# EasyEDA Pro project ProPrj_Devboard_V2_2025-07-15.epro, board PCB1
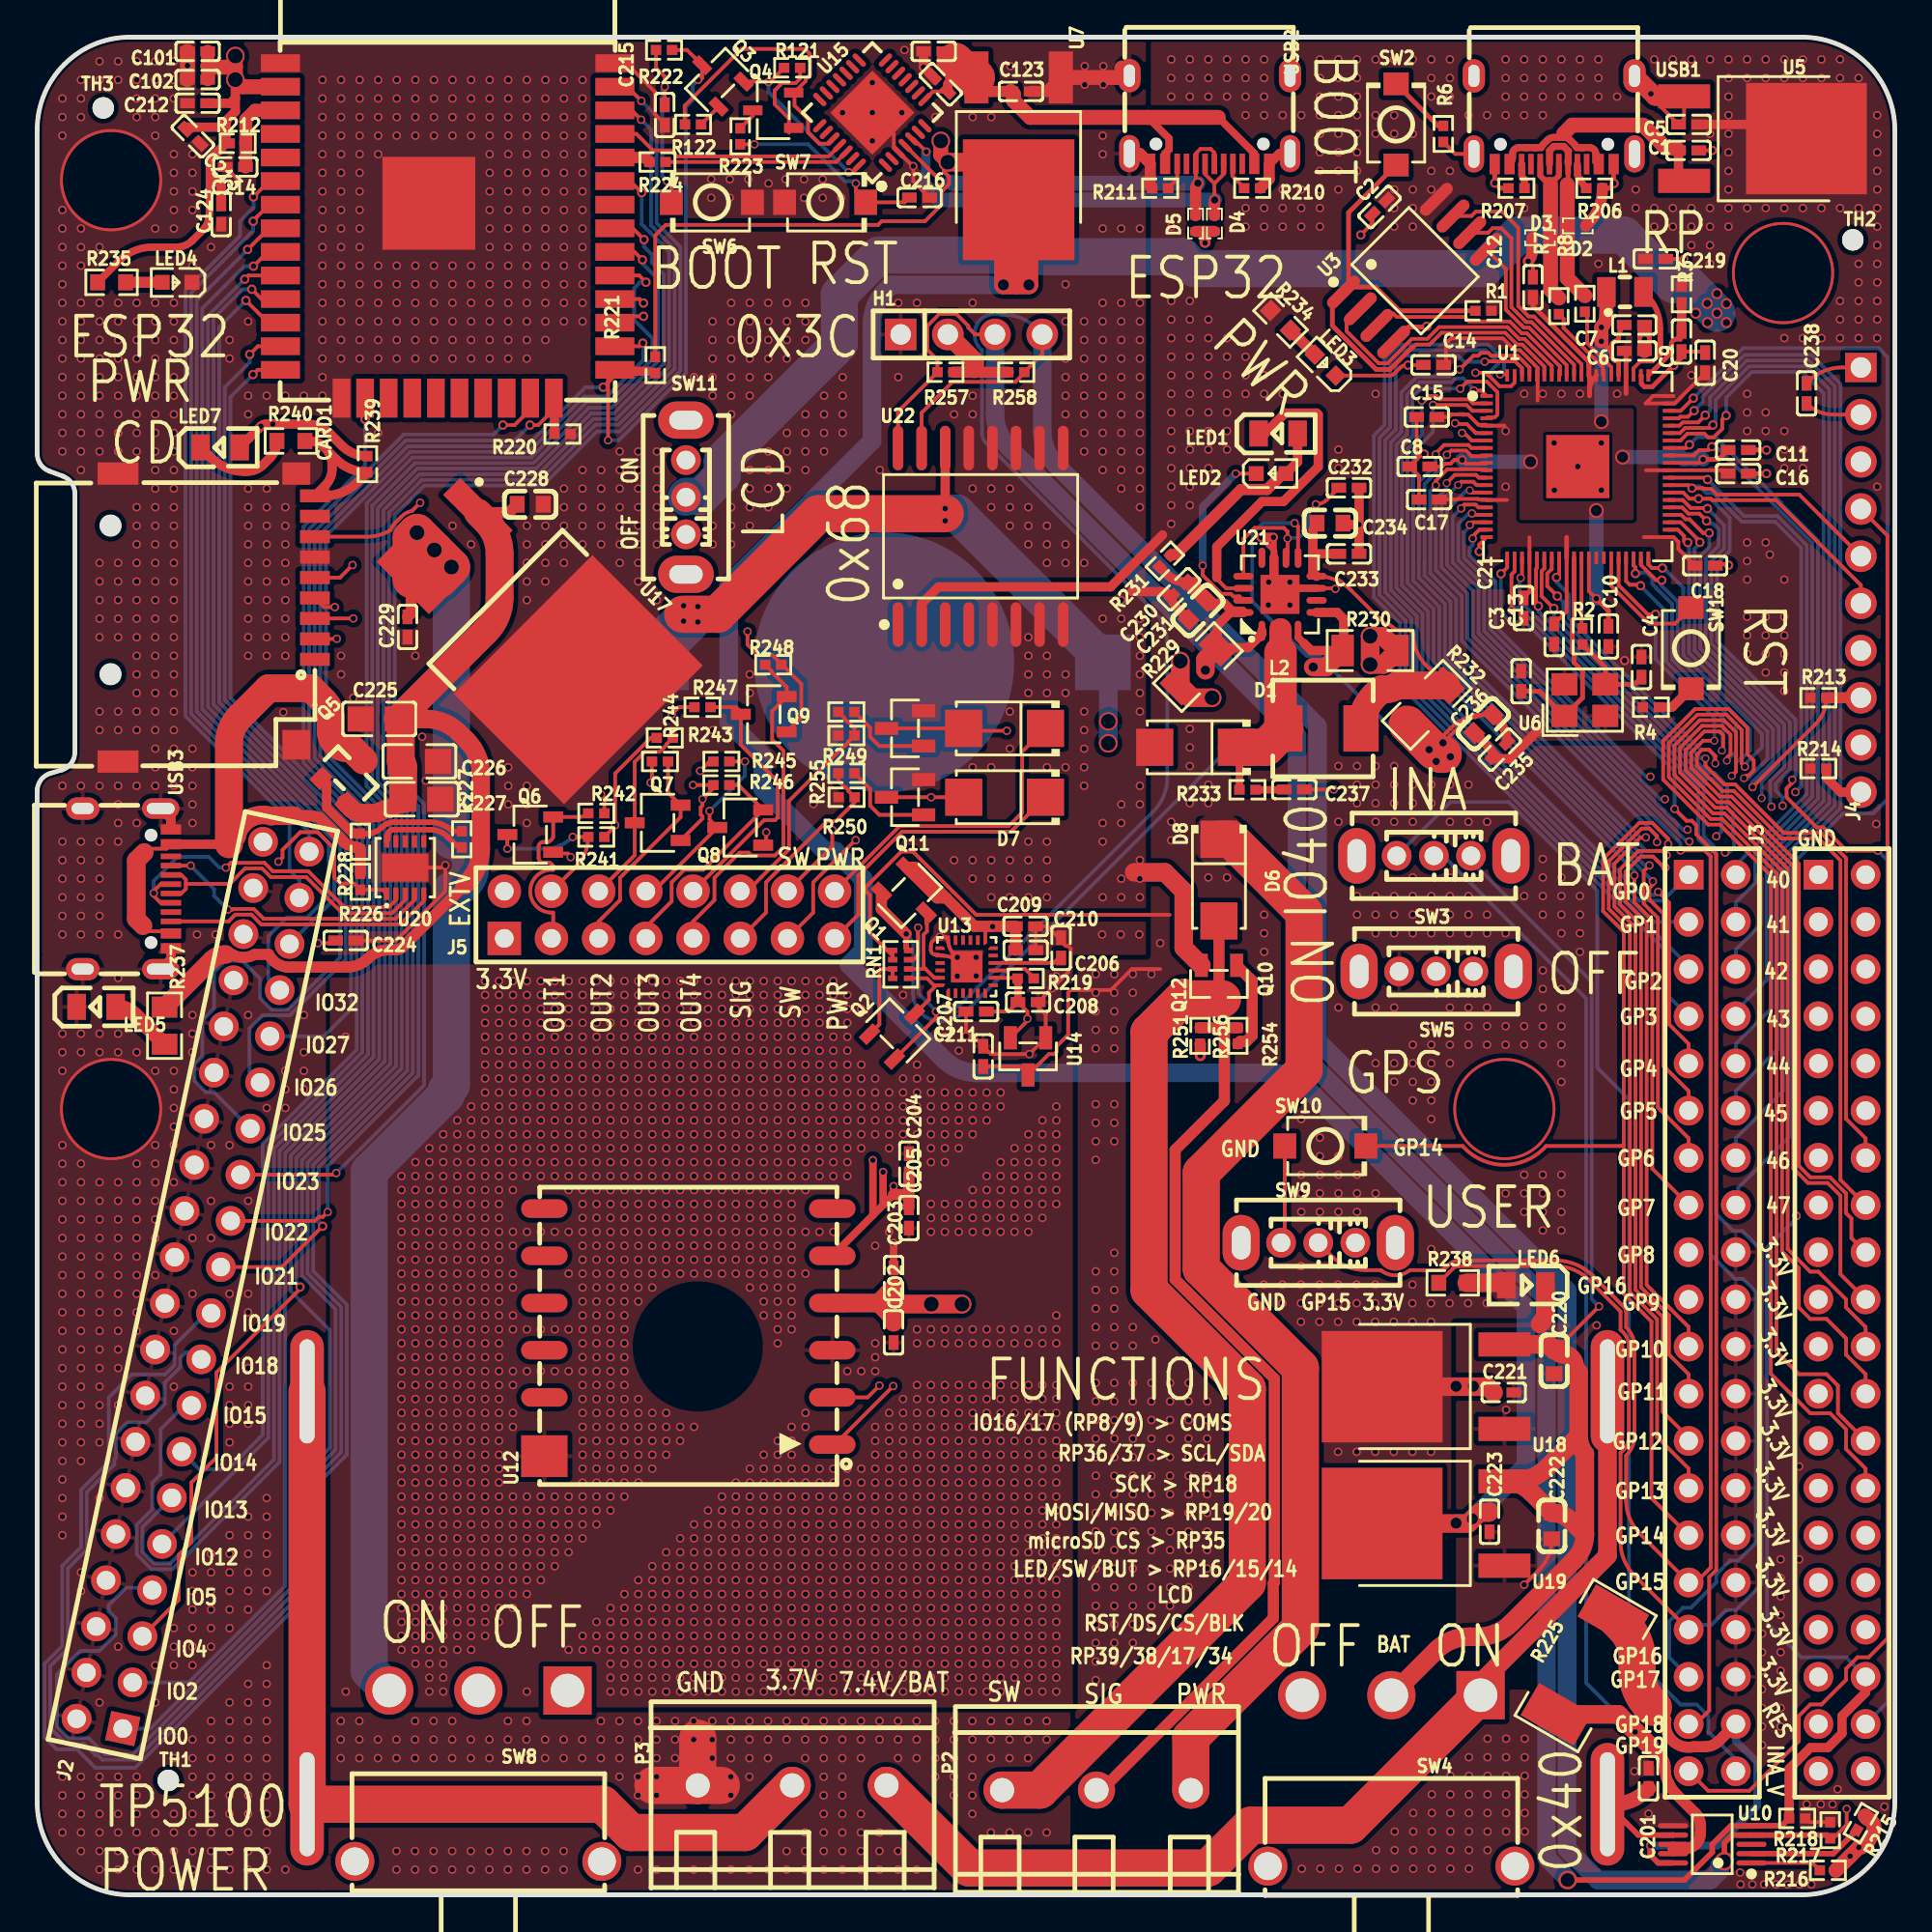
[diagram p7: board, top side]
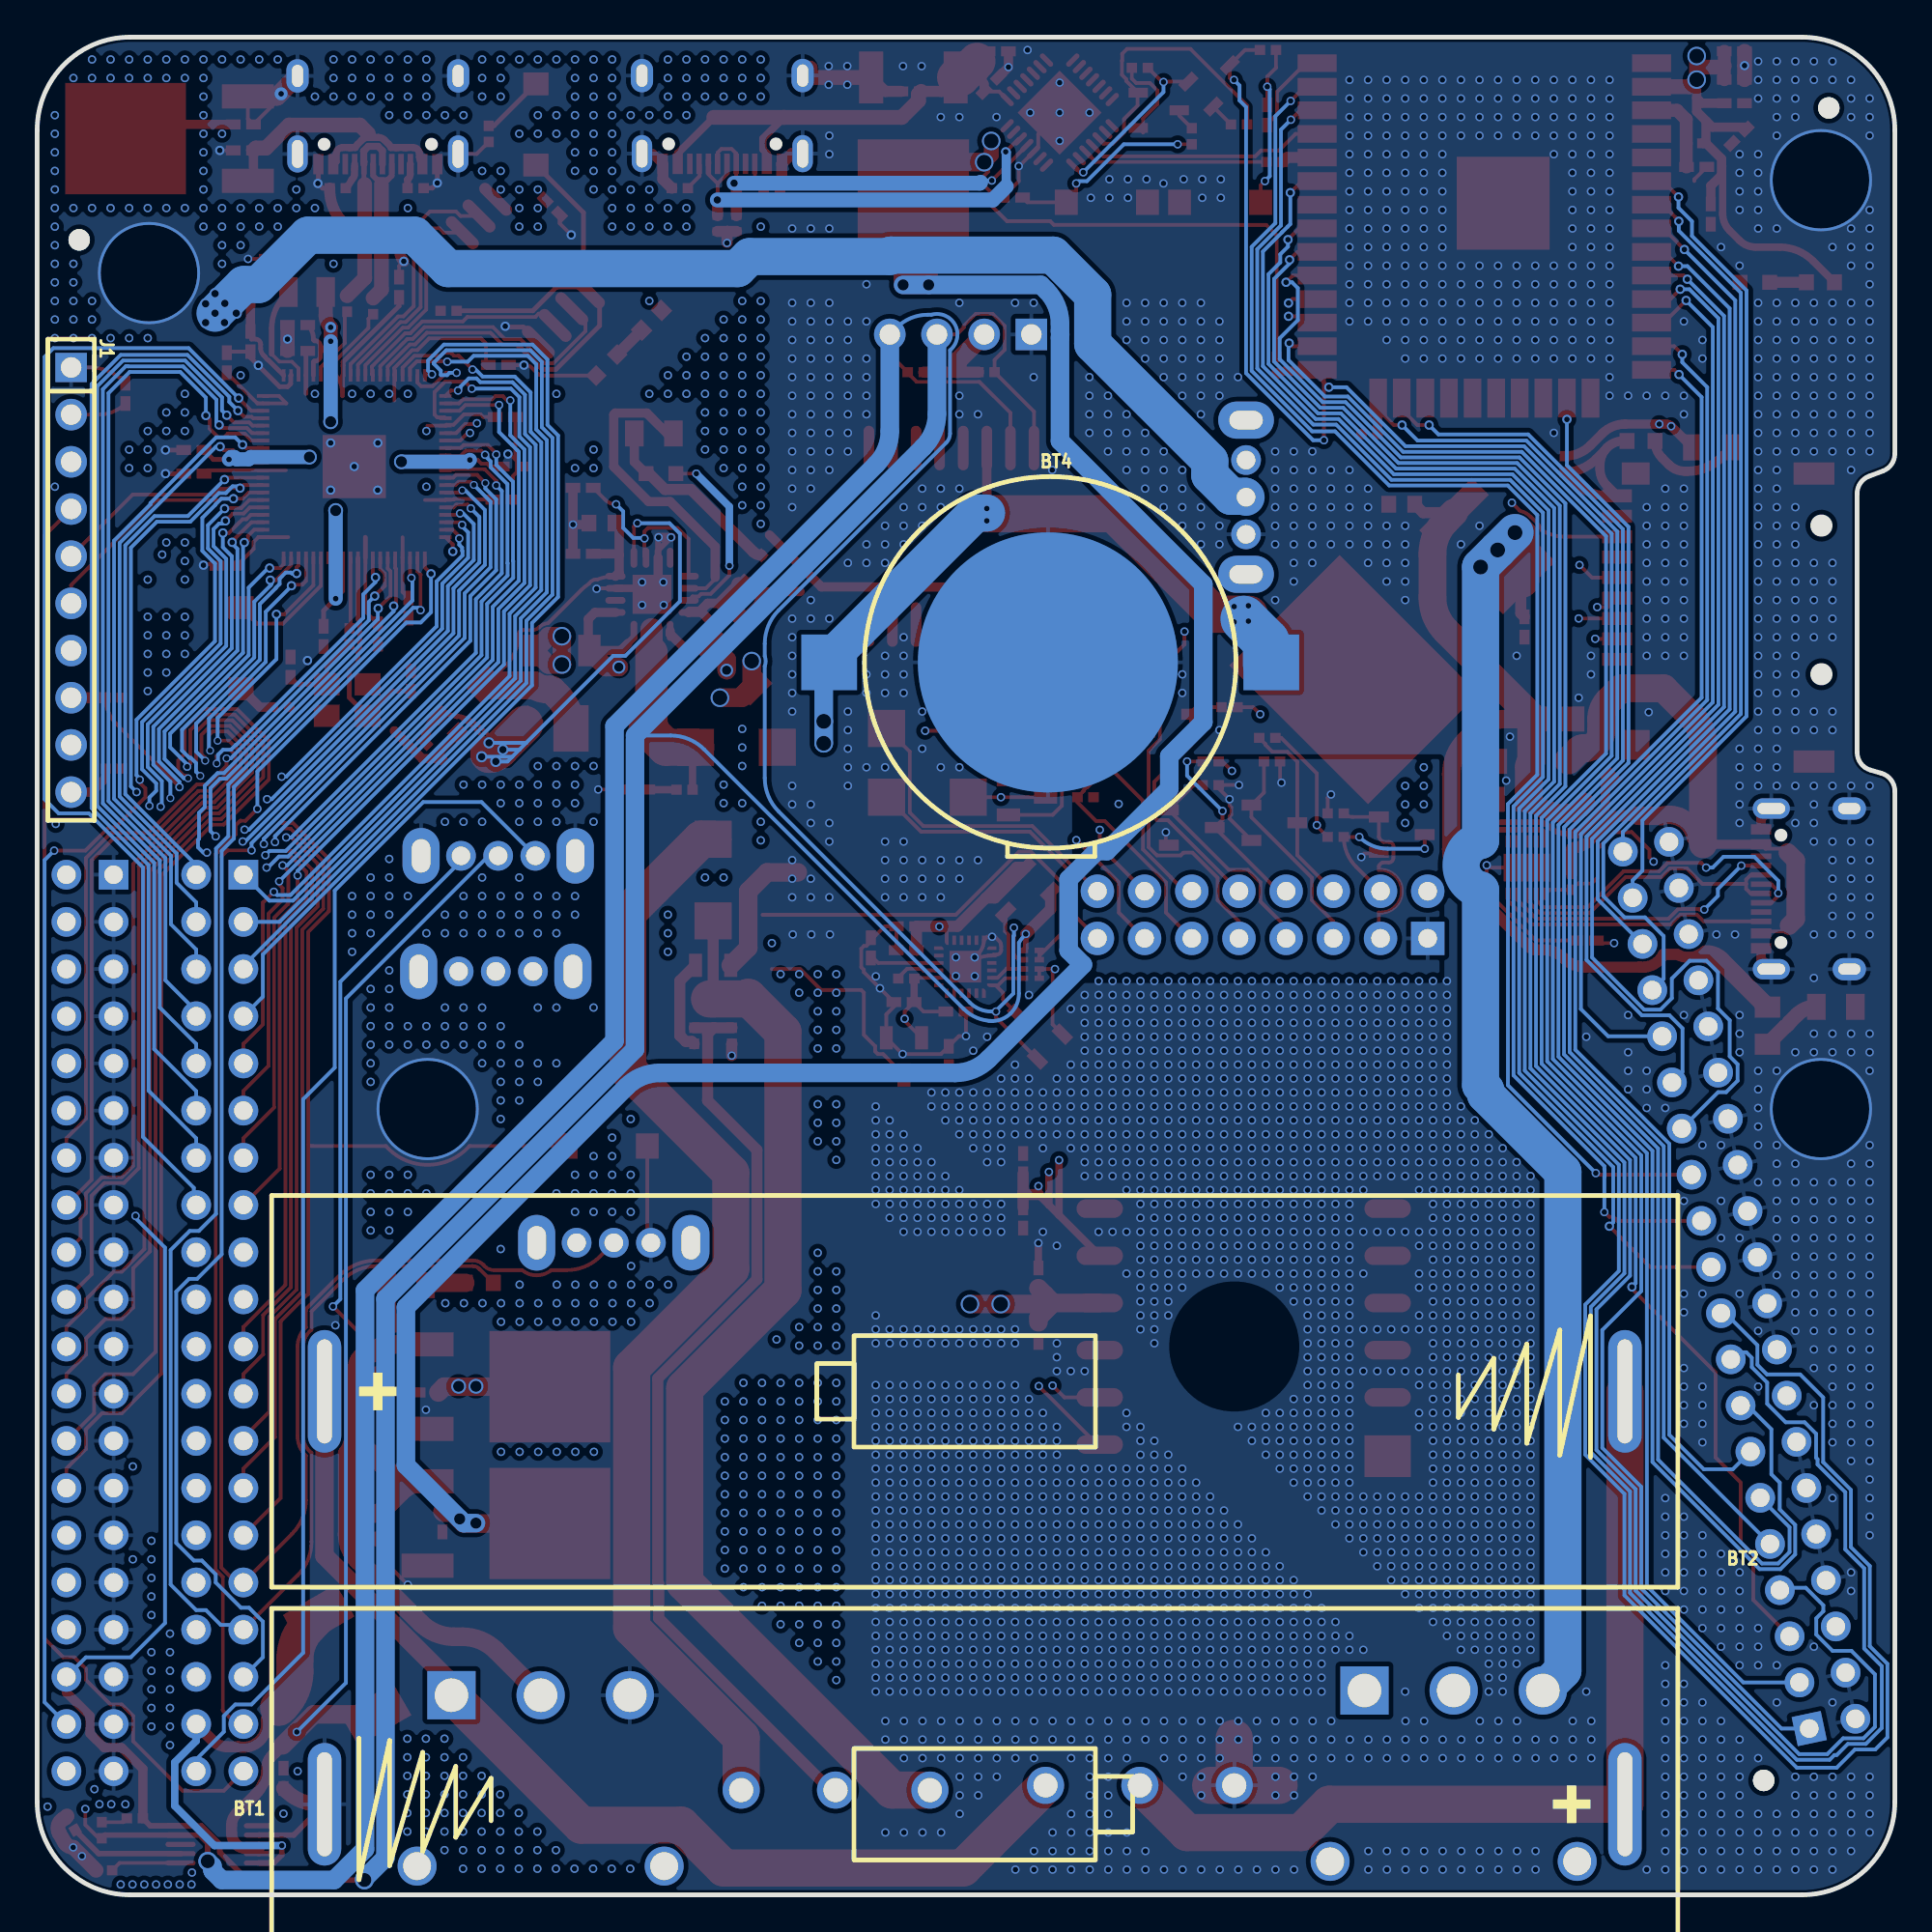
[diagram p8: board, bottom side, seen from below]

Outline 100 x 100 mm; copper layers: Top Layer, Inner1, Inner2, Bottom Layer. Coordinates in mm from the lower left corner of the outline.
Outline path: 0,95 0,77.58 arc(0.18,77.01) 0.65,76.64 1.38,76.37 arc(1.85,76) 2.03,75.43 2.03,61.51 arc(1.83,60.91) 1.31,60.55 0.72,60.37 arc(0.2,60.02) 0,59.41 0,5 arc(1.46,1.46) 5,0 95,0 arc(98.54,1.46) 100,5 100,95 arc(98.54,98.54) 95,100 5,100 arc(1.46,98.54) 0,95
Stack: Top Layer 0.035mm Outer layer thickness 1oz / Dielectric1 0.2104mm 7628 RC49% 8.6mil / Inner1 0.0152mm Inner layer thickness / Dielectric2 1.065mm 1.1mm H/HOZ Copper / Inner2 0.0152mm Inner layer thickness / Dielectric3 0.2104mm 7628 RC49% 8.6mil / Bottom Layer 0.035mm Outer layer thickness 1oz

## Design rules (mm)
template: Custom Config
spacing copperThickness1oz (default): track to track 0.102, other pairs 0.152 to 0.3
spacing copperThickness2oz: track to track 0.203, other pairs 0.152 to 0.3
track width copperThickness1oz (default): min 0.127, default 0.2, max 2.54
track width copperThickness2oz: min 0.203, default 0.254, max 2.54
differential pair differentialPair (default): width min 0.127, default 0.254, max 2.54; gap min 0.152, default 0.152
via viaSize (default): diameter min 0.4, default 0.45, max 10; hole min 0.3, default 0.3, max 6.3
pour e4 uses copperRegion1
pour e1251 uses copperRegion1

## Placement (name value [footprint] x y rotation side)
BT1  BH-18650-A1AJ006  [BAT-TH_BH-18650-A1AJ006]  49.53 4.88 180 bottom
BT2  BH-18650-A1AJ006  [BAT-TH_BH-18650-A1AJ006]  49.53 27.1 0 bottom
BT4  CR2032弯脚电池片铜 3V  [BAT-SMD_CR2032-3V]  45.47 66.34 90 bottom
C1  10uF  [C0402]  88.9 93.9 0 top
C2  100nF  [C0402]  72.26 90.86 45 top
C3  15pF  [C0402]  79.88 65.33 90 top
C4  15pF  [C0402]  86.36 66.09 270 top
C5  10uF  [C0402]  88.9 95.3 180 top
C6  4.7uF  [C0402]  85.98 83.11 0 top
C7  4.7uF  [C0402]  85.98 84.51 0 top
C8  100nF  [C0402]  74.42 76.89 180 top
C9  4.7uF  [C0402]  88.52 83.62 270 top
C10  4.7uF  [C0402]  84.58 67.74 270 top
C11  100nF  [C0402]  91.57 77.77 0 top
C12  100nF  [C0402]  80.52 86.54 90 top
C13  100nF  [C0402]  81.66 67.87 270 top
C14  100nF  [C0402]  75.17 82.36 180 top
C15  100nF  [C0402]  74.8 79.55 180 top
C16  100nF  [C0402]  91.57 76.5 0 top
C17  100nF  [C0402]  74.93 75.11 180 top
C18  100nF  [C0402]  89.79 71.55 0 top
C20  100nF  [C0402]  89.79 82.47 90 top
C21  100nF  [C0402]  80.01 69.27 270 top
C101  10uF  [C0402]  8.64 99.24 180 top
C102  100nF  [C0402]  8.64 97.71 0 top
C123  10uF  [C0402]  52.96 97.08 0 top
C124  10uF  [C0402]  9.91 90.47 270 top
C201  100nF  [C0402]  86.74 6.27 90 top
C202  100nF  [C0402]  46.1 30.28 270 top
C203  10uF  [C0402]  46.1 33.2 270 top
C204  100nF  [C0402]  46.93 39.36 270 top
C205  4.7uF  [C0402]  46.93 36.44 270 top
C206  1uF  [C0402]  53.21 50.85 180 top
C207  1uF  [C0402]  50.93 45.14 270 top
C208  100nF  [C0402]  53.34 48.06 0 top
C209  10uF  [C0402]  53.2 52.14 180 top
C210  100nF  [C0402]  55.12 50.98 90 top
C211  100nF  [C0402]  50.55 47.55 0 top
C212  1uF  [C0402]  8.64 96.44 180 top
C213  22pF  [C0402]  8.38 94.67 315 top
C214  1nF  [C0402]  10.67 93.01 180 top
C215  1nF  [C0402]  33.78 95.81 270 top
C216  1nF  [C0402]  47.5 91.36 0 top
C217  10uF  [C0402]  48.26 99.24 180 top
C218  100nF  [C0402]  48.64 97.46 315 top
C219  10uF  [C0402]  87.12 88.06 0 top
C220  10uF  [C0603]  81.66 28.75 270 top
C221  10uF  [C0402]  78.94 27.04 0 top
C222  10uF  [C0603]  81.53 19.86 270 top
C223  10uF  [C0402]  78.18 20.08 270 top
C224  1uF  [C0402]  16.61 51.37 0 top
C225  4.7uF  [C0805]  18.41 63.3 180 top
C226  4.7uF  [C0805]  20.57 61.01 0 top
C227  4.7uF  [C0805]  20.7 58.98 0 top
C228  330nF  [C0603]  26.54 74.85 0 top
C229  100nF  [C0402]  19.94 68.25 90 top
C230  100nF  [C0402]  61.47 70.28 225 top
C231  10uF  [C0603]  62.48 69.14 45 top
C232  100nF  [C0402]  70.61 75.74 0 top
C233  100nF  [C0402]  70.61 72.19 0 top
C234  10uF  [C0603]  69.6 73.84 180 top
C235  100nF  [C0402]  78.74 61.65 225 top
C236  10uF  [C0603]  77.85 63.04 45 top
C237  15pF  [C0402]  67.67 59.5 0 top
C238  100nF  [C0402]  95.25 80.82 270 top
CARD1  TF PUSH  [TF-SMD_TF-PUSH]  9.65 68.76 270 top
D1  SS34  [SMA_L4.3-W2.6-LS5.2-RD]  62.36 61.77 180 top
D2  ESD05V88D-LC  [DFN1006-2L-BI]  82.93 89.84 180 top
D3  ESD05V88D-LC  [DFN1006-2L-BI]  80.9 89.2 0 top
D4  ESD05V88D-LC  [DFN1006-2L-BI]  63.37 89.97 90 top
D5  ESD05V88D-LC  [DFN1006-2L-BI]  62.36 89.97 90 top
D6  SS34  [SMA_L4.3-W2.6-LS5.2-RD]  52.08 62.79 180 top
D7  SS34  [SMA_L4.3-W2.6-LS5.2-RD]  52.08 59.09 180 top
D8  SS34  [SMA_L4.3-W2.6-LS5.2-RD]  63.61 54.62 270 top
H1  2.54-1*4P母  [HDR-TH_4P-P2.54-V-F]  50.29 84 0 top
J1  PM2.54-1*10  [HDR-TH_10P-P2.54-V-F]  98.17 70.79 270 bottom
J2  2.54-2*20  [HDR-TH_40P-P2.54-V-F-R2-C20-S2.54]  8.38 32.82 78 top
J3  2.54-2*20  [HDR-TH_40P-P2.54-V-F-R2-C20-S2.54]  90.17 30.78 270 top
J4  2.54-2*20  [HDR-TH_40P-P2.54-V-F-R2-C20-S2.54]  97.15 30.78 270 top
J5  2.54-2*8P母  [HDR-TH_16P-P2.54-V-F-R2-C8-S2.54]  34.04 52.76 0 top
L1  AOTA-B201610S3R3-101-T  [IND-SMD_L2.0-W1.6_AOTA-B201610S3R3-101-T]  85.47 86.28 180 top
L2  10uH  [IND-SMD_L5.4-W5.2_FXL0530]  69.21 62.79 0 top
LED1  KT-0805G  [LED0805-R-RD]  66.8 78.66 0 top
LED2  KT-0603R  [LED0603-RD]  66.42 76.5 0 top
LED3  KT-0603R  [LED0603-RD]  69.34 82.35 135 top
LED4  KT-0603R  [LED0603-RD]  7.53 86.8 180 top
LED5  KT-0805Y  [LED0805-R-RD]  3.17 47.8 0 top
LED6  KT-0805G  [LED0805-R-RD]  80.14 32.82 180 top
LED7  KT-0805G  [LED0805-R-RD]  9.85 77.92 0 top
P2  WJ500V-5.08-3P  [CONN-TH_3P-P5.00_WJ500V-5.08-3P]  57.02 5.64 0 top
P3  WJ500V-5.08-3P  [CONN-TH_3P-P5.00_WJ500V-5.08-3P]  40.64 5.89 0 top
Q1  BSS138  [SOT-23-3_L2.9-W1.6-P1.90-LS2.8-BR]  46.99 53.77 135 top
Q2  BSS138  [SOT-23-3_L2.9-W1.6-P1.90-LS2.8-BR]  46.36 46.53 225 top
Q3  S8050-J3Y  [SOT-23-3_L3.0-W1.7-P0.95-LS2.9-BR]  36.58 97.71 315 top
Q4  S8050-J3Y  [SOT-23-3_L3.0-W1.7-P0.95-LS2.9-BR]  39.62 96.06 0 top
Q5  AO3401A  [SOT-23_L2.9-W1.3-P1.90-LS2.4-BR]  16.76 60.25 225 top
Q6  BSS138  [SOT-23-3_L2.9-W1.6-P1.90-LS2.8-BR]  26.54 57.07 0 top
Q7  BSS138  [SOT-23-3_L2.9-W1.6-P1.90-LS2.8-BR]  33.4 57.71 0 top
Q8  BSS138  [SOT-23-3_L2.9-W1.6-P1.90-LS2.8-BR]  37.85 57.45 0 top
Q9  BSS138  [SOT-23-3_L2.9-W1.6-P1.90-LS2.8-BR]  39.11 63.55 0 top
Q10  AO3400A  [SOT-23-3_L2.9-W1.3-P1.90-LS2.4-BR]  46.72 62.79 0 top
Q11  AO3400A  [SOT-23-3_L2.9-W1.3-P1.90-LS2.4-BR]  46.72 59.09 0 top
Q12  AO3400A  [SOT-23-3_L2.9-W1.3-P1.90-LS2.4-BR]  63.61 49.04 90 top
R1  10kΩ  [R0402]  77.85 85.27 0 top
R2  1kΩ  [R0402]  83.18 67.74 90 top
R3  33Ω  [R0402]  88.52 86.16 270 top
R4  1kΩ  [R0402]  86.87 63.93 180 top
R6  1kΩ  [R0402]  75.69 94.79 270 top
R7  27Ω  [R0402]  81.92 85.52 270 top
R8  27Ω  [R0402]  83.31 85.65 270 top
R121  12kΩ  [R0402]  40.64 98.35 0 top
R122  12kΩ  [R0402]  35.31 95.3 0 top
R206  5.1kΩ  [R0402]  83.82 91.87 0 top
R207  5.1kΩ  [R0402]  79.63 91.87 180 top
R210  5.1kΩ  [R0402]  65.4 91.87 0 top
R211  5.1kΩ  [R0402]  60.45 91.87 180 top
R212  10kΩ  [R0402]  10.8 94.28 0 top
R213  10kΩ  [R0402]  95.89 64.44 0 top
R214  10kΩ  [R0402]  95.89 60.63 0 top
R215  10kΩ  [R0402]  98.17 3.86 240 top
R216  10kΩ  [R0402]  96.39 1.32 180 top
R217  10kΩ  [R0402]  96.52 3.48 90 top
R218  10kΩ  [R0402]  94.74 4.11 0 top
R219  4.7kΩ  [R0402]  53.21 49.33 180 top
R220  4.7kΩ  [R0402]  28.28 78.64 0 top
R221  4.7kΩ  [R0402]  33.27 82.35 270 top
R222  470Ω  [R0402]  33.75 99.31 0 top
R223  470Ω  [R0402]  37.85 94.67 90 top
R224  470Ω  [R0402]  33.39 93.28 180 top
R225  20mΩ  [RES-SMD_L6.4-W3.2-R2512]  83.31 12.37 240 top
R226  10Ω  [R0402]  17.4 54.53 270 top
R227  5.1kΩ  [R0402]  22.86 56.82 270 top
R228  49.9kΩ  [R0402]  17.4 56.69 90 top
R229  400mΩ  [R1206]  62.48 66.09 45 top
R230  400mΩ  [R1206]  71.76 66.98 180 top
R231  1kΩ  [R0402]  60.71 71.81 45 top
R232  100mΩ  [R1206]  74.8 64.06 225 top
R233  3Ω  [R0402]  65.15 59.49 0 top
R234  220Ω  [R0603]  66.93 84.76 315 top
R235  220Ω  [R0603]  4.01 86.8 0 top
R237  2.7kΩ  [R0805]  6.86 46.79 270 top
R238  220Ω  [R0603]  76.2 32.94 0 top
R239  10kΩ  [R0402]  17.78 77.01 270 top
R240  220Ω  [R0603]  13.66 78.26 180 top
R241  4.7kΩ  [R0402]  30.1 56.95 180 top
R242  4.7kΩ  [R0402]  30.1 58.22 180 top
R243  4.7kΩ  [R0402]  33.78 62.28 0 top
R244  4.7kΩ  [R0402]  33.53 61.01 0 top
R245  4.7kΩ  [R0402]  36.83 61.01 0 top
R246  4.7kΩ  [R0402]  36.83 59.74 0 top
R247  4.7kΩ  [R0402]  35.81 63.93 0 top
R248  4.7kΩ  [R0402]  39.62 66.22 180 top
R249  10kΩ  [R0402]  43.56 62.41 180 top
R250  10kΩ  [R0402]  43.57 59.09 180 top
R251  10kΩ  [R0402]  62.6 46.24 270 top
R254  1kΩ  [R0402]  43.56 63.68 0 top
R255  1kΩ  [R0402]  43.56 60.38 0 top
R256  1kΩ  [R0402]  64.63 46.24 270 top
R257  10kΩ  [R0402]  48.89 81.97 0 top
R258  10kΩ  [R0402]  52.7 81.97 0 top
RN1  10kΩ  [RES-ARRAY-SMD_0402-8P-L2.0-W1.0-BL]  46.48 50.09 90 top
SW1  TS-1088-AR02016  [SW-SMD_L3.9-W3.0-P4.45]  89.03 67.11 270 top
SW2  TS-1088-AR02016  [SW-SMD_L3.9-W3.0-P4.45]  73.15 95.3 90 top
SW3  SS12D07VG4 087  [SW-TH_SS12D07VG4]  75.18 55.93 180 top
SW4  K3-1391B-51  [SW-TH_K3-1391B-51]  72.9 6.15 0 top
SW5  SS12D07VG4 087  [SW-TH_SS12D07VG4]  75.31 49.71 180 top
SW6  TS-1088-AR02016  [SW-SMD_L3.9-W3.0-P4.45]  36.32 91.11 180 top
SW7  TS-1088-AR02016  [SW-SMD_L3.9-W3.0-P4.45]  42.42 91.11 0 top
SW8  K3-1391B-51  [SW-TH_K3-1391B-51]  23.75 6.4 0 top
SW9  SS12D07VG4 087  [SW-TH_SS12D07VG4]  68.96 35.1 180 top
SW10  TS-1088-AR02016  [SW-SMD_L3.9-W3.0-P4.45]  69.34 40.31 0 top
SW11  SS12D07VG4 087  [SW-TH_SS12D07VG4]  34.92 75.23 90 top
TH1  -  [TOOLING_HOLE_JLCPCB]  7.06 6.16 0 top
TH2  -  [TOOLING_HOLE_JLCPCB]  97.74 89.09 0 top
TH3  -  [TOOLING_HOLE_JLCPCB]  3.56 96.19 0 top
U1  RP2350B  [QFN-80_L10.0-W10.0-P0.40-TL-EP3.4]  82.93 76.89 0 top
U2  ESP32-WROOM-32D-N16  [WIFIM-SMD_39P-L25.5-W18.0-P1.27-BL]  22.1 89.59 270 top
U3  W25Q128JVSIQ  [SOIC-8_L5.3-W5.3-P1.27-LS8.0-BL]  74.17 87.43 315 top
U5  NCP1117DT33RKG  [TO-252-2_L6.6-W6.1-P4.57-LS9.9-TL-CW]  91.95 94.54 0 top
U6  ABM8-272-T3  [CRYSTAL-SMD_4P-L3.2-W2.5-BL]  83.31 64.31 0 top
U7  NCP1117DT33RKG  [TO-252-2_L6.6-W6.1-P4.57-LS9.9-TL-CW]  52.83 94.54 270 top
U10  INA226AIDGSR  [MSOP-10_L3.0-W3.0-P0.50-LS5.0-BL]  90.17 2.72 90 top
U12  L80RE-M37  [GPSM-SMD_12P-L16.0-W16.0-P2.54-BL]  35.05 30.28 90 top
U13  ICM-20948  [QFN-24_L3.0-W3.0-P0.40-BL-EP]  50.04 49.96 0 top
U14  SSP6206-18NR  [SOT-23-3_L2.9-W1.3-P1.90-LS2.4-BR]  53.34 45.14 90 top
U15  CP2102-GMR  [WQFN-28_L5.0-W5.0-P0.50-BL-EP3.2]  44.96 95.94 45 top
U17  L7812CD2T-TR  [TO-263-2_L10.0-W9.1-P5.08-LS15.2-TL]  25.53 69.01 315 top
U18  NCP1117DT33RKG  [TO-252-2_L6.6-W6.1-P4.57-LS9.9-TL-CW]  75.69 27.36 180 top
U19  NCP1117DT33RKG  [TO-252-2_L6.6-W6.1-P4.57-LS9.9-TL-CW]  75.69 19.99 180 top
U20  HUSB238_002DD  [DFN-10_L3.0-W3.0-P0.50-BL-EP2.5]  19.81 55.3 0 top
U21  TP5100  [TQFN-16_L4.0-W4.0-P0.65-BL-EP]  66.9 70.01 0 top
U22  DS3231SN#T&R  [SOIC-16_L10.3-W7.5-P1.27-LS10.3-BL]  50.79 73.13 0 top
USB1  TYPE-C 16PIN 2MD(073)  [USB-C-SMD_TYPE-C-6PIN-2MD-073]  81.66 95.54 180 top
USB2  TYPE-C 16PIN 2MD(073)  [USB-C-SMD_TYPE-C-6PIN-2MD-073]  63.12 95.55 180 top
USB3  TYPE-C 16PIN 2MD(073)  [USB-C-SMD_TYPE-C-6PIN-2MD-073]  4.83 54.15 270 top

## Footprints (pads in the part's own frame, mm; a bottom-side part is the same pattern mirrored in y, then rotated)
BAT-SMD_CR2032-3V
  rect 3x3 smd: 1(0,-11.9) 1(0,11.9)
  round 14 smd: 2(0,0.127)
BAT-TH_BH-18650-A1AJ006
  oval 1.8x6.6 hole 0.8x5.6: 1(-35,0) 2(35,0)
C0402
  rect 0.79x0.54 smd: 1(-0.545,0) 2(0.545,0)
C0603
  rect 0.8x0.9 smd: 1(-0.7,0) 2(0.7,0)
C0805
  rect 1.41x1.35 smd: 1(-1,0) 2(1,0)
CONN-TH_3P-P5.00_WJ500V-5.08-3P
  round 2 hole 1.3: 1(-5.08,0) 2(0,0) 3(5.08,0)
CRYSTAL-SMD_4P-L3.2-W2.5-BL
  rect 1.4x1.2 smd: 1(-1.1,-0.85) 2(1.1,-0.85) 3(1.1,0.85) 4(-1.1,0.85)
DFN1006-2L-BI
  rect 0.45x0.55 smd: 1(-0.425,0) 2(0.425,0)
DFN-10_L3.0-W3.0-P0.50-BL-EP2.5
  rect 0.28x0.665 smd: 1(-1,-1.407) 2(-0.5,-1.407) 3(0,-1.407) 4(0.5,-1.407) 5(1,-1.407) 6(1,1.407) 7(0.5,1.407) 8(0,1.407) 9(-0.5,1.407) 10(-1,1.407)
  rect 2.5x1.5 smd: 11(0,0)
GPSM-SMD_12P-L16.0-W16.0-P2.54-BL
  oval 1x2.5 smd: 1(-6.037,-7.75) 2(-3.498,-7.75) 3(-0.958,-7.75) 4(1.583,-7.75) 5(4.122,-7.75) 6(6.662,-7.75) 7(6.662,7.75) 8(4.122,7.75) 9(1.583,7.75) 10(-0.958,7.75) 11(-3.498,7.75)
  rect 2.25x2.5 smd: 12(-6.662,7.75)
HDR-TH_4P-P2.54-V-F
  rect 1.7x1.7 hole 1.1: 1(-3.81,0)
  round 1.7 hole 1.1: 2(-1.27,0) 3(1.27,0) 4(3.81,0)
HDR-TH_10P-P2.54-V-F
  rect 1.575x1.7 hole 1.1: 1(-11.43,0)
  round 1.7 hole 1.1: 2(-8.89,0) 3(-6.35,0) 4(-3.81,0) 5(-1.27,0) 6(1.27,0) 7(3.81,0) 8(6.35,0) 9(8.89,0) 10(11.43,0)
HDR-TH_16P-P2.54-V-F-R2-C8-S2.54
  rect 1.8x1.8 hole 1: 1(-8.89,-1.27)
  round 1.8 hole 1: 2(-8.89,1.27) 3(-6.35,-1.27) 4(-6.35,1.27) 5(-3.81,-1.27) 6(-3.81,1.27) 7(-1.27,-1.27) 8(-1.27,1.27) 9(1.27,-1.27) 10(1.27,1.27) 11(3.81,-1.27) 12(3.81,1.27) 13(6.35,-1.27) 14(6.35,1.27) 15(8.89,-1.27) 16(8.89,1.27)
HDR-TH_40P-P2.54-V-F-R2-C20-S2.54
  rect 1.6x1.6 hole 1: 1(-24.13,-1.27)
  round 1.6 hole 1: 2(-24.13,1.27) 3(-21.59,-1.27) 4(-21.59,1.27) 5(-19.05,-1.27) 6(-19.05,1.27) 7(-16.51,-1.27) 8(-16.51,1.27) 9(-13.97,-1.27) 10(-13.97,1.27) 11(-11.43,-1.27) 12(-11.43,1.27) 13(-8.89,-1.27) 14(-8.89,1.27) 15(-6.35,-1.27) 16(-6.35,1.27) 17(-3.81,-1.27) 18(-3.81,1.27) 19(-1.27,-1.27) 20(-1.27,1.27) 21(1.27,-1.27) 22(1.27,1.27) 23(3.81,-1.27) 24(3.81,1.27) 25(6.35,-1.27) 26(6.35,1.27) 27(8.89,-1.27) 28(8.89,1.27) 29(11.43,-1.27) 30(11.43,1.27) 31(13.97,-1.27) 32(13.97,1.27) 33(16.51,-1.27) 34(16.51,1.27) 35(19.05,-1.27) 36(19.05,1.27) 37(21.59,-1.27) 38(21.59,1.27) 39(24.13,-1.27) 40(24.13,1.27)
IND-SMD_L2.0-W1.6_AOTA-B201610S3R3-101-T
  rect 1x1.6 smd: 1(-1,0) 2(1,0)
IND-SMD_L5.4-W5.2_FXL0530
  rect 1.9x2.5 smd: 1(-2.05,0) 2(2.05,0)
LED0603-RD
  rect 0.8x0.8 smd: 1(-0.799,0) 2(0.799,0)
LED0805-R-RD
  rect 1x1.399 smd: 1(1.05,0) 2(-1.05,0)
MSOP-10_L3.0-W3.0-P0.50-LS5.0-BL
  oval 0.28x1.62 smd: 1(-1,-2.11) 2(-0.5,-2.11) 3(0,-2.11) 4(0.5,-2.11) 5(1,-2.11) 6(1,2.11) 7(0.5,2.11) 8(0,2.11) 9(-0.5,2.11) 10(-1,2.11)
QFN-24_L3.0-W3.0-P0.40-BL-EP
  custom 0.2x0.506 smd: 1(-1,-1.427) 6(1,-1.427) 13(1,1.427) 18(-1,1.427)
  rect 0.2x0.505 smd: 2(-0.6,-1.427) 3(-0.2,-1.427) 4(0.2,-1.427) 5(0.6,-1.427) 14(0.6,1.427) 15(0.2,1.427) 16(-0.2,1.427) 17(-0.6,1.427)
  custom 0.506x0.2 smd: 7(1.427,-1) 12(1.427,1) 19(-1.427,1) 24(-1.427,-1)
  rect 0.505x0.2 smd: 8(1.427,-0.6) 9(1.427,-0.2) 10(1.427,0.2) 11(1.427,0.6) 20(-1.427,0.6) 21(-1.427,0.2) 22(-1.427,-0.2) 23(-1.427,-0.6)
  rect 1.7x1.7 smd: 25(0,0)
QFN-80_L10.0-W10.0-P0.40-TL-EP3.4
  rect 0.665x0.2 smd: 1(-4.907,3.8) 2(-4.907,3.4) 3(-4.907,3) 4(-4.907,2.6) 5(-4.907,2.2) 6(-4.907,1.8) 7(-4.907,1.4) 8(-4.907,1) 9(-4.907,0.6) 10(-4.907,0.2) 11(-4.907,-0.2) 12(-4.907,-0.6) 13(-4.907,-1) 14(-4.907,-1.4) 15(-4.907,-1.8) 16(-4.907,-2.2) 17(-4.907,-2.6) 18(-4.907,-3) 19(-4.907,-3.4) 20(-4.907,-3.8) 41(4.907,-3.8) 42(4.907,-3.4) 43(4.907,-3) 44(4.907,-2.6) 45(4.907,-2.2) 46(4.907,-1.8) 47(4.907,-1.4) 48(4.907,-1) 49(4.907,-0.6) 50(4.907,-0.2) 51(4.907,0.2) 52(4.907,0.6) 53(4.907,1) 54(4.907,1.4) 55(4.907,1.8) 56(4.907,2.2) 57(4.907,2.6) 58(4.907,3) 59(4.907,3.4) 60(4.907,3.8)
  rect 0.2x0.665 smd: 21(-3.8,-4.907) 22(-3.4,-4.907) 23(-3,-4.907) 24(-2.6,-4.907) 25(-2.2,-4.907) 26(-1.8,-4.907) 27(-1.4,-4.907) 28(-1,-4.907) 29(-0.6,-4.907) 30(-0.2,-4.907) 31(0.2,-4.907) 32(0.6,-4.907) 33(1,-4.907) 34(1.4,-4.907) 35(1.8,-4.907) 36(2.2,-4.907) 37(2.6,-4.907) 38(3,-4.907) 39(3.4,-4.907) 40(3.8,-4.907) 61(3.8,4.907) 62(3.4,4.907) 63(3,4.907) 64(2.6,4.907) 65(2.2,4.907) 66(1.8,4.907) 67(1.4,4.907) 68(1,4.907) 69(0.6,4.907) 70(0.2,4.907) 71(-0.2,4.907) 72(-0.6,4.907) 73(-1,4.907) 74(-1.4,4.907) 75(-1.8,4.907) 76(-2.2,4.907) 77(-2.6,4.907) 78(-3,4.907) 79(-3.4,4.907) 80(-3.8,4.907)
  rect 3.4x3.4 smd: 81(0,0)
R0402
  rect 0.566x0.54 smd: 1(-0.433,0) 2(0.433,0)
R0603
  rect 0.806x0.864 smd: 1(-0.753,0) 2(0.753,0)
R0805
  rect 1.133x1.377 smd: 1(-1,0) 2(1,0)
R1206
  rect 1.208x1.701 smd: 1(-1.479,0) 2(1.479,0)
RES-ARRAY-SMD_0402-8P-L2.0-W1.0-BL
  rect 0.3x0.505 smd: 1(-0.75,0.427) 2(-0.25,0.427) 3(0.25,0.427) 4(0.75,0.427) 5(0.75,-0.427) 6(0.25,-0.427) 7(-0.25,-0.427) 8(-0.75,-0.427)
RES-SMD_L6.4-W3.2-R2512
  rect 2x3.3 smd: 1(-3.067,0) 2(3.067,0)
SMA_L4.3-W2.6-LS5.2-RD
  rect 2x2 smd: 1(-2.2,0) 2(2.2,0)
SOIC-8_L5.3-W5.3-P1.27-LS8.0-BL
  oval 0.63x2.25 smd: 1(-1.905,-3.53) 2(-0.635,-3.53) 3(0.635,-3.53) 4(1.905,-3.53) 5(1.905,3.53) 6(0.635,3.53) 7(-0.635,3.53) 8(-1.905,3.53)
SOIC-16_L10.3-W7.5-P1.27-LS10.3-BL
  oval 0.574x2.401 smd: 1(-4.445,-4.75) 2(-3.175,-4.75) 3(-1.905,-4.75) 4(-0.635,-4.75) 5(0.635,-4.75) 6(1.905,-4.75) 7(3.175,-4.75) 8(4.445,-4.75) 9(4.445,4.75) 10(3.175,4.75) 11(1.905,4.75) 12(0.635,4.75) 13(-0.635,4.75) 14(-1.905,4.75) 15(-3.175,4.75) 16(-4.445,4.75)
SOT-23-3_L2.9-W1.3-P1.90-LS2.4-BR
  rect 1.25x0.7 smd: 1(1,-0.95) 2(1,0.95) 3(-1,0)
SOT-23-3_L2.9-W1.6-P1.90-LS2.8-BR
  rect 1.07x0.6 smd: 1(1.235,-0.95) 2(1.235,0.95) 3(-1.235,0)
SOT-23-3_L3.0-W1.7-P0.95-LS2.9-BR
  rect 1.038x0.532 smd: 1(1.102,-0.95) 2(1.102,0.95) 3(-1.101,0)
SOT-23_L2.9-W1.3-P1.90-LS2.4-BR
  rect 1x0.8 smd: 1(1.15,-0.95) 2(1.15,0.95) 3(-1.15,0)
SW-SMD_L3.9-W3.0-P4.45
  rect 1.23x1.36 smd: 1(-2.185,0) 2(2.185,0)
SW-TH_K3-1391B-51
  rect 2.6x2.6 hole 1.8: 1(4.8,4.6)
  round 2.6 hole 1.8: 2(0,4.6) 3(-4.8,4.6)
  round 2.1 hole 1.5: 4(-6.65,-4.6) 4(6.65,-4.6)
SW-TH_SS12D07VG4
  oval 1.6x1.6 hole 1: 1(-2,0) 2(0,0) 3(2,0)
  oval 2x3 hole 1x1.8: 4(4.15,0) 5(-4.15,0)
TF-SMD_TF-PUSH
  rect 0.7x1.6 smd: 1(2.25,5.3) 2(1.15,5.3) 3(0.05,5.3) 4(-1.05,5.3) 5(-2.15,5.3) 6(-3.25,5.3) 7(-4.35,5.3) 8(-5.45,5.3) CD(-6.55,5.3)
  rect 1.2x1.5 smd: 10(-7.75,4.3)
  rect 1.2x2.2 smd: 11(-7.75,-5.3) 12(7.75,-5.3)
  rect 1.6x1.5 smd: 13(6.85,4.3)
TO-252-2_L6.6-W6.1-P4.57-LS9.9-TL-CW
  rect 2.8x1.3 smd: 1(-3.292,2.273) 3(-3.292,-2.273)
  rect 6.5x6 smd: 2(3.292,0)
TO-263-2_L10.0-W9.1-P5.08-LS15.2-TL
  rect 4x1.3 smd: 1(-5.086,2.54) 3(-5.086,-2.54)
  rect 8.4x10.566 smd: 4(5.086,0)
TOOLING_HOLE_JLCPCB
  round 1.152 hole 1.152: 0(0,0)
TQFN-16_L4.0-W4.0-P0.65-BL-EP
  oval 0.364x1.087 smd: 1(-0.975,-1.968) 2(-0.325,-1.968) 3(0.325,-1.968) 4(0.975,-1.968) 9(0.975,1.968) 10(0.325,1.968) 11(-0.325,1.968) 12(-0.975,1.968)
  oval 1.087x0.364 smd: 5(1.968,-0.975) 6(1.968,-0.325) 7(1.968,0.325) 8(1.968,0.975) 13(-1.968,0.975) 14(-1.968,0.325) 15(-1.968,-0.325) 16(-1.968,-0.975)
  rect 2.1x2.1 smd: 17(0,0)
USB-C-SMD_TYPE-C-6PIN-2MD-073
  rect 0.55x1.1 smd: 1(-3.2,2.375) 2(-2.4,2.375) 11(2.4,2.375) 12(3.2,2.375)
  rect 0.3x1.1 smd: 3(-1.75,2.375) 4(-1.25,2.375) 5(-0.75,2.375) 6(-0.25,2.375) 7(0.25,2.375) 8(0.75,2.375) 9(1.25,2.375) 10(1.75,2.375)
  oval 1.1x2 hole 0.6x1.5: 13(-4.325,1.825) 14(4.325,1.825)
  oval 1.2x1.8 hole 0.6x1.2: 13(-4.325,-2.375) 14(4.325,-2.375)
WIFIM-SMD_39P-L25.5-W18.0-P1.27-BL
  rect 0.95x2.1 smd: 1(-9.015,-9) 2(-7.745,-9) 3(-6.475,-9) 4(-5.205,-9) 5(-3.935,-9) 6(-2.665,-9) 7(-1.395,-9) 8(-0.125,-9) 9(1.145,-9) 10(2.415,-9) 11(3.685,-9) 12(4.955,-9) 13(6.225,-9) 14(7.495,-9) 25(7.495,9) 26(6.225,9) 27(4.955,9) 28(3.685,9) 29(2.415,9) 30(1.145,9) 31(-0.125,9) 32(-1.395,9) 33(-2.665,9) 34(-3.935,9) 35(-5.205,9) 36(-6.475,9) 37(-7.745,9) 38(-9.015,9)
  rect 2.1x0.95 smd: 15(9.015,-5.715) 16(9.015,-4.445) 17(9.015,-3.175) 18(9.015,-1.905) 19(9.015,-0.635) 20(9.015,0.635) 21(9.015,1.905) 22(9.015,3.175) 23(9.015,4.445) 24(9.015,5.715)
  rect 5x5 smd: 39(-1.472,-1.017)
WQFN-28_L5.0-W5.0-P0.50-BL-EP3.2
  oval 0.28x0.9 smd: 1(-1.502,-2.5) 2(-1.001,-2.5) 3(-0.5,-2.5) 4(0,-2.5) 5(0.5,-2.5) 6(1,-2.5) 7(1.501,-2.5) 15(1.501,2.5) 16(1,2.5) 17(0.5,2.5) 18(0,2.5) 19(-0.5,2.5) 20(-1.001,2.5) 21(-1.502,2.5)
  oval 0.9x0.28 smd: 8(2.5,-1.502) 9(2.5,-1.001) 10(2.5,-0.5) 11(2.5,0) 12(2.5,0.5) 13(2.5,1) 14(2.5,1.501) 22(-2.5,1.501) 23(-2.5,1) 24(-2.5,0.5) 25(-2.5,0) 26(-2.5,-0.5) 27(-2.5,-1.001) 28(-2.5,-1.502)
  rect 3.2x3.2 smd: 29(0,0)

## Nets
As in the schematic, except:
$4N7638: C238.2 J1.2 SW11.2

Pads without a net: CARD1 1 8; SW4 4; SW5 1 4 5; SW8 1 4; SW9 1 4 5; SW11 4 5; TH1 0; TH2 0; TH3 0; U2 4 5 17 18 19 20 21 22 32; U12 6 7 8 9 10 11; U13 1 2 3 4 5 6 14 15 16 17 19; U15 6 7 9 10 11 12 13 14 15 16 17 18 19 20 21 22; U20 6 7 8 9; U21 6 12; USB1 3 9; USB2 3 9; USB3 3 9

## Via types
v1: diameter 0.45, hole 0.3, Top Layer to Bottom Layer, 3710 vias
v2: diameter 0.5, hole 0.305, Top Layer to Bottom Layer, 69 vias
v3: diameter 0.5, hole 0.3, Top Layer to Bottom Layer, 2 vias
v4: diameter 5.5, hole 5.2, Top Layer to Bottom Layer, 4 vias
v5: diameter 0.7, hole 0.305, Top Layer to Bottom Layer, 1 via
v6: diameter 0.8, hole 0.6, Top Layer to Bottom Layer, 10 vias
v7: diameter 0.6, hole 0.305, Top Layer to Bottom Layer, 2 vias
v8: diameter 0.42, hole 0.3, Top Layer to Bottom Layer, 11 vias
v9: diameter 1, hole 0.75, Top Layer to Bottom Layer, 2 vias
v10: diameter 0.45, hole 0.305, Top Layer to Bottom Layer, 1 via
v11: diameter 1, hole 0.8, Top Layer to Bottom Layer, 15 vias
v12: diameter 0.6, hole 0.4, Top Layer to Bottom Layer, 13 vias
v13: diameter 0.7, hole 0.5, Top Layer to Bottom Layer, 2 vias

## Routing (per net, layer and track width the routed paths; a pad name or vN(x,y) marks a point on that pad's centre or on a via; arc(x,y) is an arc through that point)
1.1V: length 35.1
  Top Layer w0.2: U1.32 83.53,70.17 v2(83.93,69.77) ; C8.1 75.63,76.89 75.78,77.04 76.08,77.04 76.28,77.24 v2(76.71,77.24) 76.91,77.04 77.98,77.04 U1.10 ; U1.51 89.49,77.09 v2(89.68,77.27)
  Top Layer w0.254: v7(84.2,83.63) 84.6,83.24 arc(84.72,83.05) 84.76,82.84 ; U1.65 85.13,82.51 arc(85.11,82.54) 85.08,82.56 85.04,82.56 arc(84.84,82.64) 84.76,82.84 ; C11.1 90.51,77.27 v2(89.68,77.27) ; C10.1 84.58,69.12 v2(83.93,69.77) ; 84.76,82.84 84.76,83.38 arc(84.84,83.58) 85.04,83.66 85.07,83.66 arc(85.11,83.68) 85.13,83.72 85.13,83.77 arc(85.21,84.17) C7.1
  Top Layer w0.762: v7(84.2,83.63) v7(84.2,84.38) arc(84.4,84.68) 84.47,85.03 L1.2
  Bottom Layer w0.762: v6(85.34,77.4) 88.5,77.4 88.62,77.28 89.27,77.28 89.39,77.4 89.55,77.4 v2(89.68,77.27) ; v6(84.2,79.3) v7(84.2,83.63) ; v6(83.93,74.52) v2(83.93,69.77) ; v2(76.71,77.24) 76.81,77.14 v6(80.39,77.14)
1.8V: length 37.2
  Top Layer w0.2: Q2.1 45.34,46.86 45.34,49.71 v1(45.21,49.83) 46.05,49.83 RN1.2 RN1.1 ; 51.32,52.14 51.04,51.85 U13.13 ; U14.2 53.3,47.05 v1(53.3,47.16) 53.3,47.55 C208.1 52.29,47.55 C211.2 ; 51.42,52.14 v1(51.43,52.12) ; U13.8 52.74,49.36
  Top Layer w0.4: R219.2 52.8,49.31 C208.1
  Top Layer w0.6: C206.2 52.67,52.13 C209.2 50.46,52.14 48.93,53.66 ; 48.93,53.66 48.44,53.66 Q1.1 47.27,55.32 48.93,53.66
  Inner2 w0.2: v1(53.3,47.16) 53.3,50.25 v1(51.43,52.12) 50.17,52.12 47.88,49.83 v1(45.21,49.83)
3.3V: length 144.7
  Top Layer w0.2: C21.1 80.33,70.13 U1.24 80.33,73.08 ; U1.60 86.98,80.69 86.58,80.29 U1.59 88.15,80.29 C20.1 ; v1(30.35,59.23) 30.53,59.05 R242.1 ; C18.1 88.35,72.45 88.35,72.82 88.09,73.09 U1.41 86.49,73.09 ; v1(35.31,59.74) R246.1 36.4,59.56 v1(35.81,58.98) 35.81,58.64 35.72,58.54 35.72,58.15 35.81,58.05 35.81,57.94 Q7.1 ; 60.45,49.83 58.93,49.83 57.8,48.71 55.64,48.71 55.5,48.56 55.5,46.29 54.89,45.69 54.89,45.41 54.74,45.26 54.46,45.26 U14.3 52.89,44.59 C207.2 ; 75.84,82.49 75.84,83.51 76.12,83.79 78.9,83.79 79.53,83.15 79.82,83.15 80.78,82.19 80.78,81.84 U1.76 80.77,81.75 80.77,80.44 ; C17.1 76.45,75.11 76.49,75.14 77.56,75.14 77.59,75.11 78,75.11 U1.15 79.12,75.09 ; 46.05,50.55 44.83,51.77 44.83,53.81 44.68,53.96 arc(44.6,54.14) 44.68,54.32 46.52,56.16 47.14,56.16 50.55,52.76 60.96,52.76 ; 46.05,50.55 RN1.3 ; 46.05,50.55 RN1.4 ; CARD1.4 15.44,69.32 v1(16.02,69.32) ; v1(38.24,68) 38.24,67.31 38.8,66.74 39.58,66.74 41.14,65.18 41.14,63.39 Q9.1 ; 33.09,61.01 33.09,59.94 v1(33.02,59.87) ; U1.29 82.33,69.08 C13.1 ; R217.2 95.38,3.91 R218.2 ; 86.61,76.69 U1.50 90.84,76.69 C16.1 ; Q6.1 27.84,56.06 28.58,56.06 ; v1(39.24,57.2) 39.24,56.67 39.08,56.5 ; C15.1 75.99,79.55 76.13,79.69 77.03,79.69 77.59,79.13 77.98,79.13 U1.5 78.99,79.09
  Top Layer w0.254: U1.29 82.33,73.08 ; 83.57,80.91 83.57,80.7 ; 83.57,80.91 83.57,81.71 arc(83.56,81.75) U1.69 83.53,82.33 ; 83.57,80.91 arc(83.66,81.39) U1.68 ; 85.53,80.82 U1.64 85.53,82.87 arc(85.51,83) C6.1 ; 80.52,85.99 80.52,85.53 83.53,82.52 83.53,82.33 arc(83.53,82.34) 83.53,82.34
  Top Layer w0.5: U22.2 47.61,69.51 48.51,70.41 57.79,70.41 60.58,73.2 ; U5.2 94.48,95.3 89.45,95.3 ; LED7.1 v1(12.04,79.06) arc(12.17,79.14) 12.32,79.17 v1(12.68,79.17) 14.52,79.17 arc(15.19,79.04) 15.75,78.66 16.39,78.02 arc(17.03,77.6) R239.1
  Top Layer w0.6: R257.2 R258.1
  Top Layer w1: U18.2 78.09,27.36 C221.1 ; 50.46,82.15 50.46,82.56 H1.2
  vias: v1(28.72,55.86) v1(56.98,49.56) v1(56.98,48.56) v1(56.98,47.56) v1(56.98,46.56) v1(56.98,45.56) v1(56.98,42.56) v1(56.98,41.56) v1(56.98,40.56) v1(56.98,39.56) v1(56.98,33.56) v1(56.98,32.56) v1(56.98,31.56) v1(56.98,30.56) v1(56.98,29.56) v1(56.98,27.56) v1(56.98,26.56) v1(56.98,25.56) v1(56.98,24.56) v1(56.98,23.56) v1(56.98,22.56) v1(56.98,21.56) v1(56.98,20.56) v1(56.98,19.56) v1(56.98,18.56) v1(56.98,17.56) v1(56.98,16.56) v1(56.98,15.56) v1(56.98,14.56) v1(56.98,13.56) v1(56.98,12.56) v1(56.98,11.56) v1(57.98,49.56) v1(57.98,48.56) v1(57.98,47.56) v1(57.98,46.56) v1(57.98,45.56) v1(57.98,42.56) v1(57.98,41.56) v1(57.98,40.56) v1(57.98,34.56) v1(57.98,33.56) v1(57.98,32.56) v1(57.98,31.56) v1(57.98,30.56) v1(57.98,29.56) v1(57.98,27.56) v1(57.98,26.56) v1(57.98,25.56) v1(57.98,24.56) v1(57.98,23.56) v1(57.98,22.56) v1(57.98,21.56) v1(57.98,20.56) v1(57.98,19.56) v1(57.98,18.56) v1(57.98,17.56) v1(57.98,16.56) v1(57.98,15.56) v1(57.98,14.56) v1(57.98,13.56) v1(57.98,12.56) v1(58.98,49.56) v1(58.98,48.56) v1(58.98,30.56) v1(58.98,29.56) v1(58.98,27.56) v1(58.98,26.56) v1(58.98,25.56) v1(58.98,24.56) v1(58.98,23.56) v1(58.98,22.56) v1(58.98,21.56) v1(58.98,20.56) v1(58.98,19.56) v1(58.98,18.56) v1(58.98,17.56) v1(58.98,16.56) v1(58.98,15.56) v1(58.98,14.56) v1(58.98,13.56) v1(59.98,49.56) v1(59.98,27.56) v1(59.98,26.56) v1(59.98,25.56) v1(59.98,24.56) v1(59.98,23.56) v1(59.98,22.56) v1(59.98,21.56) v1(59.98,20.56) v1(59.98,19.56) v1(59.98,18.56) v1(59.98,17.56) v1(59.98,16.56) v1(59.98,15.56) v1(59.98,14.56) v1(60.2,29.9) v1(60.45,51.23) v1(60.98,27.56) v1(60.98,26.56) v1(60.98,25.56) v1(60.98,24.56) v1(60.98,23.56) v1(60.98,22.56) v1(60.98,21.56) v1(60.98,20.56) v1(60.98,19.56) v1(60.98,18.56) v1(60.98,17.56) v1(60.98,16.56) v1(60.98,15.56) v1(61.05,98.8) v1(61.05,97.8) v1(61.05,96.8) v1(61.05,89.8) v1(61.05,85.8) v1(61.05,84.8) v1(61.05,83.8) v1(61.05,82.8) v1(61.05,81.8) v1(61.05,80.8) v1(61.05,79.8) v1(61.05,78.8) v1(61.05,77.8) v1(61.05,76.8) v1(61.05,75.8) v1(61.05,74.8) v1(61.05,73.8) v1(61.05,57.76) v1(61.05,56.76) v1(61.98,27.56) v1(61.98,26.56) v1(61.98,25.56) v1(61.98,24.56) v1(61.98,23.56) v1(61.98,22.56) v1(61.98,21.56) v1(61.98,20.56) v1(61.98,19.56) v1(61.98,18.56) v1(61.98,17.56) v1(61.98,16.56) v1(62.05,98.8) v1(62.05,97.8) v1(62.05,96.8) v1(62.05,85.8) v1(62.05,84.8) v1(62.05,83.8) v1(62.05,82.8) v1(62.05,81.8) v1(62.05,80.8) v1(62.05,79.8) v1(62.05,78.8) v1(62.05,77.8) v1(62.05,76.8) v1(62.05,75.8) v1(62.05,74.8) v1(62.05,62.76) v1(62.05,61.76) v1(62.05,60.76) v1(62.05,58.76) v1(62.98,26.56) v1(62.98,25.56) v1(62.98,24.56) v1(62.98,23.56) v1(62.98,22.56) v1(62.98,21.56) v1(62.98,20.56) v1(62.98,19.56) v1(62.98,18.56) v1(62.98,17.56) v1(63.05,98.8) v1(63.05,97.8) v1(63.05,96.8) v1(63.05,84.8) v1(63.05,83.8) v1(63.05,82.8) v1(63.05,81.8) v1(63.05,80.8) v1(63.05,79.8) v1(63.05,78.8) v1(63.05,77.8) v1(63.05,76.8) v1(63.05,59.76) v1(63.05,58.76) v1(63.05,54.76) v1(64.05,98.8) v1(64.05,97.8) v1(64.05,96.8) v1(64.05,83.8) v1(64.05,82.8) v1(64.05,81.8) v1(64.05,80.8) v1(64.05,79.8) v1(64.05,78.8) v1(64.05,77.8) v1(64.05,54.76) v1(65.05,98.8) v1(65.05,97.8) v1(65.05,96.8) v1(65.05,95.8) v1(65.05,90.8) v1(65.05,89.8) v1(65.05,82.8) v1(65.05,81.8) v1(65.05,80.8) v1(66.05,98.8) v1(66.05,97.8) v1(66.05,96.8) v1(66.05,95.8) v1(66.05,90.8) v1(66.05,89.8) v1(66.05,81.8) v1(66.05,80.8) v1(66.05,52.76) v1(66.05,51.76) v1(66.05,50.76) v1(66.03,32.85) v1(67.05,95.8) v1(67.05,91.8) v1(67.05,90.8) v1(67.05,89.8) v1(67.05,85.8) v1(67.05,80.8) v1(67.03,32.85) v1(67.03,31.85) v1(68.05,95.8) v1(68.05,91.8) v1(68.05,90.8) v1(68.05,89.8) v1(68.05,41.76) v1(68.05,38.76) v1(68.05,37.76) v1(68.05,36.76) v1(68.03,33.85) v1(68.03,32.85) v1(68.03,31.85) v1(68.03,30.85) v1(68.07,1.41) v1(69.05,98.8) v1(69.05,97.8) v1(69.05,96.8) v1(69.05,95.8) v1(69.05,94.8) v1(69.05,93.8) v1(69.05,92.8) v1(69.05,91.8) v1(69.05,90.8) v1(69.05,89.8) v1(69.05,40.76) v1(69.05,39.76) v1(69.05,38.76) v1(69.05,37.76) v1(69.05,36.76) v1(69.03,32.85) v1(69.03,31.85) v1(69.03,30.85) v1(69.07,1.41) v1(70.05,98.8) v1(70.05,97.8) v1(70.05,96.8) v1(70.05,95.8) v1(70.05,94.8) v1(70.05,93.8) v1(70.05,92.8) v1(70.05,91.8) v1(70.05,77.8) v1(70.05,76.8) v1(70.05,60.76) v1(70.05,57.76) v1(70.05,47.76) v1(70.05,39.76) v1(70.05,38.76) v1(70.05,37.76) v1(70.05,36.76) v1(70.03,32.85) v1(70.03,31.85) v1(70.03,30.85) v1(70.03,23.85) v1(70.07,1.41) v1(71.05,98.8) v1(71.05,97.8) v1(71.05,96.8) v1(71.05,95.8) v1(71.05,94.8) v1(71.05,93.8) v1(71.05,92.8) v1(71.05,76.8) v1(71.05,60.76) v1(71.05,59.76) v1(71.05,58.76) v1(71.05,53.76) v1(71.05,52.76) v1(71.05,38.76) v1(71.05,37.76) v1(71.05,36.76) v1(71.03,32.85) v1(71.03,31.85) v1(71.03,30.85) v1(71.03,23.85) v1(71.07,1.41) v1(72.05,98.8) v1(72.05,95.8) v1(72.05,94.8) v1(72.05,80.8) v1(72.05,60.76) v1(72.05,59.76) v1(72.05,58.76) v1(72.05,57.76) v1(72.05,53.76) v1(72.05,52.76) v1(72.05,51.76) v1(72.05,47.76) v1(72.05,44.76) v1(72.05,37.76) v1(72.03,32.85) v1(72.03,31.85) v1(72.03,30.85) v1(72.03,23.85) v1(72.07,2.41) v1(72.07,1.41) v1(73.05,98.8) v1(73.05,95.8) v1(73.05,94.8) v1(73.05,91.8) v1(73.05,90.8) v1(73.05,89.8) v1(73.05,60.76) v1(73.05,59.76) v1(73.05,58.76) v1(73.05,57.76) v1(73.05,53.76) v1(73.05,52.76) v1(73.05,51.76) v1(73.05,47.76) v1(73.05,44.76) v1(73.05,43.76) v1(73.03,31.85) v1(73.03,30.85) v1(73.03,23.85) v1(73.07,3.41) v1(73.07,2.41) v1(73.07,1.41) v1(74.05,98.8) v1(74.05,94.8) v1(74.05,91.8) v1(74.05,90.8) v1(74.05,89.8) v1(74.05,59.76) v1(74.05,58.76) v1(74.05,57.76) v1(74.05,54.76) v1(74.05,53.76) v1(74.05,52.76) v1(74.05,51.76) v1(74.05,45.76) v1(74.05,44.76) v1(74.05,43.76) v1(74.05,42.76) v1(74.03,32.85) v1(74.03,31.85) v1(74.03,30.85) v1(74.03,23.85) v1(74.07,4.41) v1(74.07,3.41) v1(74.07,2.41) v1(74.07,1.41) v1(75.05,98.8) v1(75.05,97.8) v1(75.05,96.8) v1(75.05,92.8) v1(75.05,91.8) v1(75.05,59.76) v1(75.05,58.76) v1(75.05,53.76) v1(75.05,52.76) v1(75.05,51.76) v1(75.05,46.76) v1(75.05,45.76) v1(75.05,44.76) v1(75.05,43.76) v1(75.05,42.76) v1(75.05,41.76) v1(75.05,34.76) v1(75.03,31.85) v1(75.03,30.85) v1(75.03,23.85) v1(75.07,5.41) v1(75.07,4.41) v1(75.07,3.41) v1(75.07,2.41) v1(75.07,1.41) v1(76.05,98.8) v1(76.05,97.8) v1(76.05,96.8) v1(76.05,92.8) v1(76.05,59.76) v1(76.05,57.76) v1(76.05,54.76) v1(76.05,53.76) v1(76.05,52.76) v1(76.05,51.76) v1(76.05,47.76) v1(76.05,46.76) v1(76.05,45.76) v1(76.05,44.76) v1(76.03,31.85) v1(76.07,6.41) v1(76.07,5.41) v1(76.07,4.41) v1(76.07,3.41) v1(76.07,2.41) v1(76.07,1.41) v1(77.05,95.8) v1(77.05,59.76) v1(77.05,57.76) v1(77.05,53.76) v1(77.05,52.76) v1(77.05,51.76) v1(77.05,47.76) v1(77.05,46.76) v1(77.05,45.76) v1(77.03,31.85) v1(77.07,7.41) v1(77.07,6.41) v1(77.07,5.41) v1(77.07,4.41) v1(77.07,3.41) v1(77.07,2.41) v1(77.07,1.41) v1(78.05,95.8) v1(78.05,57.76) v1(78.05,52.76) v1(78.05,51.76) v1(78.05,47.76) v1(78.05,46.76) v1(78.05,45.76) v1(78.03,31.85) v1(78.07,8.41) v1(78.07,7.41) v1(78.07,6.41) v1(78.07,5.41) v1(78.07,4.41) v1(78.07,3.41) v1(78.07,2.41) v1(79.05,98.8) v1(79.05,97.8) v1(79.05,96.8) v1(79.05,95.8) v1(79.05,78.8) v1(79.05,75.8) v1(79.05,51.76) v1(79.05,46.76) v1(79.05,45.76) v1(79.05,37.76) v1(79.07,8.41) v1(79.07,7.41) v1(79.07,6.41) v1(79.07,5.41) v1(79.07,4.41) v1(79.07,3.41) v1(80.05,98.8) v1(80.05,97.8) v1(80.05,96.8) v1(80.05,95.8) v1(80.05,90.8) v1(80.05,80.8) v1(80.05,53.76) v1(80.05,46.76) v1(80.05,45.76) v1(80.05,38.76) v1(80.05,37.76) v1(80.05,36.76) v1(80.07,8.41) v1(80.07,7.41) v1(80.07,6.41) v1(80.07,5.41) v1(80.07,4.41) v1(80.07,3.41) v1(81.05,98.8) v1(81.05,97.8) v1(81.05,96.8) v1(81.05,95.8) v1(81.05,80.8) v1(81.05,55.76) v1(81.05,54.76) v1(81.05,53.76) v1(81.05,52.76) v1(81.05,49.76) v1(81.05,48.76) v1(81.05,47.76) v1(81.05,46.76) v1(81.05,45.76) v1(81.05,38.76) v1(81.05,37.76) v1(81.05,36.76) v1(81.05,35.76) v1(82.05,98.8) v1(82.05,97.8) v1(82.05,96.8) v1(82.05,80.8) v1(82.05,54.76) v1(82.05,53.76) v1(82.05,52.76) v1(82.05,51.76) v1(82.05,48.76) v1(82.05,47.76) v1(82.05,46.76) v1(82.05,45.76) v1(82.05,44.76) v1(82.05,43.76) v1(82.05,38.76) v1(82.05,37.76) v1(82.05,36.76) v1(82.05,35.76) v1(83.05,98.8) v1(83.05,97.8) v1(83.05,96.8) v1(83.05,80.8) v1(83.05,53.76) v1(83.05,52.76) v1(83.05,51.76) v1(83.05,50.76) v1(84.05,98.8) v1(84.05,97.8) v1(84.05,96.8) v1(84.05,87.8) v1(85.05,96.8) v1(85.05,90.8) v1(85.05,80.8) v1(85.98,6.66) v1(86.05,91.8) v1(86.05,90.8) v1(86.74,4.37) v1(87.05,98.8) v1(87.05,90.8) v1(87.05,89.8) v1(88.05,98.8) v1(88.05,90.8) v1(88.05,89.8) v1(89.05,98.8) v1(89.05,90.8) v1(89.05,89.8) v1(89.05,88.8) v1(89.05,81.8) v1(90.05,98.8) v1(90.05,94.8) v1(90.05,90.8) v1(90.05,89.8) v1(90.05,88.8) v1(90.05,87.8) v1(91.05,98.8) v1(91.05,97.8) v1(91.05,96.8) v1(91.05,95.8) v1(91.05,94.8) v1(91.05,93.8) v1(91.05,92.8) v1(91.05,91.8) v1(91.05,90.8) v1(91.05,89.8) v1(91.67,1.2) v1(91.69,0.56) v1(92.05,98.8) v1(92.05,97.8) v1(92.05,90.8) v1(92.05,80.8) v1(92.05,79.8) v1(92.05,78.8) v1(92.05,72.8) v1(92.05,71.8) v1(92.05,70.8) v1(92.05,68.8) v1(92.05,67.8) v1(92.05,66.8) v1(92.33,0.56) v1(92.85,14.06) v1(92.85,13.06) v1(92.85,12.06) v1(92.85,11.06) v1(92.85,10.06) v1(92.85,9.06) v1(92.85,8.06) v1(92.96,0.56) v1(93.05,98.8) v1(93.05,97.8) v1(93.05,90.8) v1(93.05,79.8) v1(93.05,78.8) v1(93.05,72.8) v1(93.05,68.8) v1(93.05,67.8) v1(93.05,66.8) v1(93.05,65.8) v1(93.27,72.15) v1(93.6,0.56) v1(93.85,19.06) v1(93.85,18.06) v1(93.85,17.06) v1(93.85,16.06) v1(93.85,15.06) v1(93.85,13.06) v1(93.85,12.06) v1(93.85,11.06) v1(93.85,10.06) v1(93.85,9.06) v1(94.05,98.8) v1(94.05,97.8) v1(94.05,90.8) v1(94.05,83.8) v1(94.05,78.8) v1(94.05,77.8) v1(94.05,76.8) v1(94.05,70.8) v1(94.05,68.8) v1(94.05,67.8) v1(94.05,66.8) v1(94.05,65.8) v1(94.05,64.8) v1(94.23,0.56) v1(94.85,23.06) v1(94.85,18.06) v1(94.87,0.56) v1(95.05,98.8) v1(95.05,97.8) v1(95.05,90.8) v1(95.05,83.8) v1(95.05,77.8) v1(95.05,76.8) v1(95.25,4.88) v1(95.5,0.56) v1(96.05,98.8) v1(96.05,97.8) v1(96.05,90.8) v1(96.05,83.8) v1(96.01,4.88) v1(96.65,4.88) v1(96.92,5.69) v1(97.05,98.8) v1(97.05,97.8) v1(97.05,90.8) v1(97.05,85.8) v1(97.05,84.8) v1(97.05,83.8) v1(98.05,97.8) v1(98.05,90.8) v1(98.05,87.8) v1(98.05,86.8) v1(98.05,85.8) v1(98.05,84.8) v1(98.05,83.8) v1(99.05,95.8) v1(99.05,94.8) v1(99.05,93.8) v1(99.05,92.8) v1(99.05,91.8) v1(99.05,90.8) v1(99.05,89.8) v1(99.05,88.8) v1(99.05,87.8) v1(99.05,86.8) v1(99.05,85.8) v1(99.05,84.8) v1(99.05,83.8) v1(99.05,75.8) v1(99,57.65) v1(99.44,4.75) v6(76.38,27.38) v6(77.31,27.38)
3.7V: length 50
  Top Layer w2: BT2.1 BT1.2 30.44,4.88 31.96,3.35 38.1,3.35 P3.2
7.4V: length 68.8
  Top Layer w0.2: 81.33,29.63 82.03,29.63 v1(84.07,31.67)
  Top Layer w1: 83.31,19.4 82.59,20.13 arc(82.1,20.45) C222.1 80.44,21.66 arc(79.77,22.11) U19.3 79.49,22.26 arc(80.46,22.46) 81.28,23.01 82.98,24.7 ; 83.31,19.4 83.31,23.74 arc(83.06,24.19) 82.98,24.7 ; 83.31,19.4 arc(83.16,18.65) 82.74,18.02 79.36,14.64 arc(78.53,14.09) 77.56,13.89 77.1,13.89 arc(76.13,13.7) 75.3,13.15 SW4.2 ; 82.98,24.7 82.98,28.12 arc(82.97,28.13) 82.96,28.15 82.8,28.31 arc(82.77,28.35) 82.76,28.4 82.76,28.45 arc(82.57,28.91) 82.11,29.1 arc(82.02,29.12) 81.94,29.18 81.66,29.45 ; U18.3 81.33,29.63 81.66,29.3
  Bottom Layer w0.2: SW3.1 77.18,55.65 83.68,49.15 83.68,32.07 v1(84.07,31.67)
12V: length 77.9
  Top Layer w0.6: C229.2 20.13,68.99 U17.3
  Top Layer w2: v11(21.38,72.39) 20.13,71.15 ; v11(21.38,72.39) v11(20.45,73.33) 20.13,73.02 20.13,71.15 ; v11(21.38,72.39) v11(22.3,71.48) 21.64,70.81 U17.3 20.13,71.15
  Bottom Layer w2: v11(20.45,73.33) v11(21.38,72.39) v11(22.3,71.48) 22.3,56.76 arc(23.35,55.42) 22.3,54.09 22.3,43.6 22.03,43.32 22.03,43.08 17.87,38.92 17.87,12.08 SW8.3
20V: length 55.4
  Top Layer w0.6: C228.1 25.39,74.4 U17.1 ; 23,54.35 19.67,51.02 arc(19.51,50.91) 19.32,50.87 18.93,50.87 arc(18.33,50.75) 17.81,50.41 arc(17.29,50.06) 16.69,49.94 13.72,49.94 arc(13.58,49.93) 13.45,49.94 arc(12.87,50.16) 12.47,50.62 11.71,50.62 arc(11.1,50.46) 10.49,50.62 10.14,50.62
  Top Layer w1: C227.1 19.68,58.96 arc(19.37,58.7) 19.02,58.48 arc(18.79,58.44) 18.57,58.36 arc(18.47,58.32) 18.37,58.26 arc(18.13,58.23) 17.89,58.22 17.53,58.22 arc(17.2,58.28) 16.92,58.47 Q5.2 ; R237.1 9.37,50.3 arc(9.73,50.54) 10.14,50.62 ; 23,54.35 23.13,54.48 arc(23.68,55.3) 23.88,56.27 23.88,60.34 arc(23.68,61.31) 23.13,62.14 22.72,62.55 arc(21.89,63.1) 20.92,63.3 C225.1
  Top Layer w1.5: U17.1 24.15,73.98 arc(24.7,73.16) 24.89,72.19 24.89,69.83 arc(24.7,68.85) 24.15,68.03 C225.1 arc(19.53,63.12) 19.57,62.91 C226.1 arc(19.67,60.87) 19.7,60.7 C227.1
+5V: length 15.2
  Top Layer w0.381: USB1.2 83.95,93.27 arc(83.94,93.28) 83.92,93.29 arc(83.91,93.29) 83.9,93.3 83.9,93.71 arc(83.8,93.96) 83.56,94.06 83.26,94.06 arc(83.21,94.05) 83.16,94.04 arc(83.11,94.05) 83.06,94.06 82.87,94.06 arc(82.83,94.14) 82.76,94.22 82.52,94.46 arc(82.36,94.57) 82.18,94.6 81.65,94.6 arc(81.46,94.57) 81.3,94.46 81.07,94.23 arc(81.01,94.15) 80.96,94.06 80.76,94.06 arc(80.71,94.05) 80.66,94.04 arc(80.61,94.05) 80.56,94.06 80.26,94.06 arc(80.21,94.05) 80.16,94.04 arc(80.11,94.05) 80.06,94.06 79.76,94.06 arc(79.52,93.96) 79.42,93.71 79.42,93.54 arc(79.38,93.34) 79.26,93.16
  Top Layer w0.5: U5.3 88.36,92.57 C1.1
  Top Layer w0.8: 82.18,94.81 82.63,95.27 86.44,95.27 87.68,94.03 88.23,94.03 C1.1
GND: length 166
  Top Layer w0.2: C238.1 95.36,81.48 arc(96.18,82.03) 97.15,82.22 J1.1 ; v1(80.05,16.7) 80.84,17.49 arc(81.35,18.26) 81.53,19.16 ; 90.27,71.63 91,71.63 v2(91.05,71.58) ; C9.2 89.74,83.07 C20.2 ; C2.1 71.88,89.98 v2(71.25,89.35) ; C216.2 47.16,92.25 v1(47.16,93.06) 47.13,93.06 U15.3 46.11,94.07 46.11,94.78 v1(44.96,95.94) ; 74.75,82.49 74.61,82.34 v2(73.8,82.34) 73.67,82.34 arc(73.52,82.31) 73.4,82.23 73.05,81.88 arc(72.94,81.81) 72.82,81.79 arc(72.81,81.78) 72.81,81.78 LED3.1 ; 50.02,49.98 v1(49.53,50.47) 49.34,50.66 arc(49.21,50.82) 49.11,51.01 arc(49.1,51.05) 49.08,51.08 arc(49.05,51.23) U13.18 48.85,51.57 v1(48.6,51.57) 48.44,51.57 48.19,51.32 arc(48.14,51.24) 48.12,51.15 arc(48.12,51.14) 48.12,51.14 arc(48.11,51.1) 48.11,51.06 48.11,50.86 arc(48.18,50.68) 48.36,50.61 48.51,50.61 arc(48.55,50.6) 48.59,50.57 48.6,50.57 arc(48.61,50.56) U13.20 arc(49.37,50.41) 50.02,49.98 ; 50.02,49.98 U13.25 ; C211.1 v1(50,46.23) 50.38,46.23 C207.1 51.35,45.26 v1(53.41,45.26) U14.1 54.29,47.4 53.76,47.93 v1(54.63,48.8) 55.5,49.67 55.5,49.79 55.64,49.93 55.64,50.93 55.49,51.08 55.37,51.08 54.99,51.45 54.99,51.52 54.38,52.14 53.75,52.14 53.75,50.86 C206.1 ; SW10.1 67.16,35.58 arc(67.11,35.32) SW9.3 ; 68.22,59.5 v1(69.8,59.5) ; v2(80.26,87.93) 80.52,87.68 C12.2 ; 74.39,75.36 74.39,76.38 C8.2 74.26,77.27 ; 74.39,75.36 74.13,75.11 ; 74.39,75.36 C17.2 ; v2(74.66,77.56) 74.55,77.56 74.26,77.27 ; USB1.14 76.34,93.71 R6.2 ; 74.26,77.27 C15.2 ; C219.2 v1(88.65,88.06) ; C214.2 10.8,92.34 10.8,92.25 ; v2(90.17,93.9) 89.45,93.9 ; U21.7 69.82,70.33 arc(69.86,70.32) v1(69.89,70.3) ; U21.11 66.58,72.38 ; U5.1 88.66,95.6 C5.2 87.08,96.57 ; 31.1,98.6 31.71,98.6 33.26,97.05 33.26,95.85 33.78,95.33 C215.2 ; U20.11 21.84,55.3 v1(21.97,55.42) 21.97,54.03 19.32,51.37 C224.2
  Top Layer w0.254: C16.2 v2(93.09,76.5) ; U1.62 86.35,81.77 86.35,81.35 86.52,81.18 86.95,81.18 v2(88.09,82.33) 88.52,82.75 C9.2 ; 84.86,93.16 84.86,92.15 v3(84.89,92.13) 84.63,91.87 R206.2 ; USB1.12 v3(78.46,92.15) 78.74,91.87 R207.2 ; v2(74.8,84.44) 74.76,84.39 73.83,84.39 U3.4 ; C11.2 v2(93.09,77.77)
  Top Layer w0.3: v1(66.55,73.08) 66.58,73.05 66.58,72.38 v1(65.88,73.08) ; 88.05,3.23 U10.7 86.19,3.22 BT1.1
  Top Layer w0.4: U21.17 67.23,70.33 U21.7 ; C203.1 v1(46.1,35.09)
  Top Layer w0.5: C233.2 v1(71.16,73.76) ; v1(71.16,73.76) C232.2 ; v1(71.16,73.76) 70.48,73.76 arc(70.38,73.78) C234.1 ; 47.71,99.24 v1(47.71,98.39) C218.1 ; USB2.13 66.87,93.73 USB2.1 ; C236.1 78.15,61.75 arc(78.3,61.53) C235.2 78.46,61.16 79.27,61.16 80.77,62.66 ; USB3.12 7.2,50.38 USB3.14 ; USB3.13 7.2,57.93 USB3.1 ; R215.1 98.73,3.89 ; C231.1 61.33,69.31 arc(61.15,69.58) C230.2 arc(60.8,70.09) 60.46,70.15 58.93,70.15 ; U21.17 66.58,70.33 U21.11 ; v1(66.55,73.08) v1(65.88,73.08)
  Top Layer w0.6: D3.1 80.47,88.44 arc(80.42,88.17) v2(80.26,87.93) ; R210.2 66.32,92.35 USB2.1 ; v1(62.61,45.17) 62.61,45.8 R251.2 ; R211.2 59.92,91.97 USB2.12 59.37,93.73 USB2.14 ; C123.2 54.35,97.08 U7.1 ; R206.2 84.25,91.79 arc(84.06,90.82) 83.51,89.99 D2.1 ; 62.86,88.95 62.86,89.48 arc(62.86,89.52) 62.84,89.54 ; D5.1 62.84,89.54 ; 62.84,89.54 D4.1
  Top Layer w0.762: 86.52,84.32 v2(86.52,83.74) C6.2
  Top Layer w0.8: C101.2 v2(8.09,98.47) C102.1 ; C201.1 86.63,5.62 arc(85.81,5.07) 84.84,4.88 BT1.1 ; 58.39,98.34 USB2.14 ; R216.1 v1(97.59,2.08) v1(98.06,2.55) arc(98.29,2.61) 98.47,2.76 arc(98.5,2.79) 98.52,2.83 98.81,3.32 arc(98.86,3.74) 98.61,4.07 98.49,4.14 arc(98.44,4.2) 98.4,4.24 ; U7.1 58.26,97.83
  Top Layer w1: LED6.2 81.19,31.43 arc(81.11,31.05) 80.9,30.73 ; 59.05,55.04 60.71,55.04 61.72,54.03 61.72,50.98 Q12.2 ; U5.1 87.09,96.81 USB1.13
  Top Layer w2: P3.1 33.15,5.89 ; P3.1 35.56,8.43 ; P3.1 36.83,5.89
  vias: v1(1.36,96.7) v1(1.36,95.7) v1(1.36,94.7) v1(1.36,90.7) v1(1.36,89.7) v1(1.36,88.7) v1(1.36,87.7) v1(1.36,86.7) v1(1.36,85.7) v1(1.36,84.7) v1(1.36,83.7) v1(1.36,82.7) v1(1.36,81.7) v1(1.36,80.7) v1(1.36,79.7) v1(1.36,78.7) v1(1.36,77.7) v1(1.36,59.7) v1(1.36,56.7) v1(1.36,55.7) v1(1.36,54.7) v1(1.36,53.7) v1(1.36,52.7) v1(1.36,51.7) v1(1.36,46.36) v1(1.36,45.36) v1(1.36,44.36) v1(1.36,40.36) v1(1.36,39.36) v1(1.36,38.36) v1(1.36,37.36) v1(1.36,36.36) v1(1.36,35.36) v1(1.36,34.36) v1(1.36,33.36) v1(1.36,32.36) v1(1.36,31.36) v1(1.36,30.36) v1(1.36,29.36) v1(1.36,28.36) v1(1.36,27.36) v1(1.36,26.36) v1(1.36,25.36) v1(1.36,24.36) v1(1.36,23.36) v1(1.36,22.36) v1(1.36,21.36) v1(1.36,20.36) v1(1.36,19.36) v1(1.36,6.36) v1(1.36,5.36) v1(1.36,4.36) v1(1.36,3.36) v1(2.36,97.7) v1(2.36,96.7) v1(2.36,95.7) v1(2.36,89.7) v1(2.36,88.7) v1(2.36,87.7) v1(2.36,85.7) v1(2.36,84.7) v1(2.36,83.7) v1(2.36,82.7) v1(2.36,81.7) v1(2.36,80.7) v1(2.36,79.7) v1(2.36,78.7) v1(2.36,77.7) v1(2.36,76.7) v1(2.36,59.7) v1(2.36,56.7) v1(2.36,55.7) v1(2.36,54.7) v1(2.36,53.7) v1(2.36,52.7) v1(2.36,51.7) v1(2.36,46.36) v1(2.36,45.36) v1(2.36,39.36) v1(2.36,38.36) v1(2.36,37.36) v1(2.36,36.36) v1(2.36,35.36) v1(2.36,34.36) v1(2.36,33.36) v1(2.36,32.36) v1(2.36,31.36) v1(2.36,30.36) v1(2.36,29.36) v1(2.36,28.36) v1(2.36,27.36) v1(2.36,26.36) v1(2.36,25.36) v1(2.36,24.36) v1(2.36,23.36) v1(2.36,17.36) v1(2.36,16.36) v1(2.36,6.36) v1(2.36,5.36) v1(2.36,4.36) v1(2.36,3.36) v1(2.36,2.36) v1(3.36,98.7) v1(3.36,97.7) v1(3.36,88.7) v1(3.36,85.7) v1(3.36,84.7) v1(3.36,83.7) v1(3.36,82.7) v1(3.36,81.7) v1(3.36,80.7) v1(3.36,79.7) v1(3.36,78.7) v1(3.36,77.7) v1(3.36,71.7) v1(3.36,70.7) v1(3.36,69.7) v1(3.36,68.7) v1(3.36,67.7) v1(3.36,63.7) v1(3.36,62.7) v1(3.36,59.7) v1(3.36,56.7) v1(3.36,55.7) v1(3.36,54.7) v1(3.36,53.7) v1(3.36,52.7) v1(3.36,51.7) v1(3.36,46.36) v1(3.36,45.36) v1(3.36,38.36) v1(3.36,37.36) v1(3.36,36.36) v1(3.36,35.36) v1(3.36,34.36) v1(3.36,33.36) v1(3.36,32.36) v1(3.36,31.36) v1(3.36,30.36) v1(3.36,29.36) v1(3.36,28.36) v1(3.36,27.36) v1(3.36,26.36) v1(3.36,25.36) v1(3.36,24.36) v1(3.36,21.36) v1(3.36,10.36) v1(3.36,6.36) v1(3.36,5.36) v1(3.36,4.36) v1(3.36,3.36) v1(3.36,2.36) v1(3.36,1.36) v1(4.36,98.7) v1(4.36,97.7) v1(4.36,85.7) v1(4.36,84.7) v1(4.36,83.7) v1(4.36,82.7) v1(4.36,81.7) v1(4.36,80.7) v1(4.36,79.7) v1(4.36,78.7) v1(4.36,77.7) v1(4.36,71.7) v1(4.36,70.7) v1(4.36,69.7) v1(4.36,68.7) v1(4.36,67.7) v1(4.36,63.7) v1(4.36,62.7) v1(4.36,59.7) v1(4.36,58.7) v1(4.36,57.7) v1(4.36,56.7) v1(4.36,51.7) v1(4.36,49.36) v1(4.36,46.36) v1(4.36,45.36) v1(4.36,38.36) v1(4.36,37.36) v1(4.36,36.36) v1(4.36,35.36) v1(4.36,34.36) v1(4.36,33.36) v1(4.36,32.36) v1(4.36,31.36) v1(4.36,30.36) v1(4.36,29.36) v1(4.36,28.36) v1(4.36,26.36) v1(4.36,13.36) v1(4.36,6.36) v1(4.36,5.36) v1(4.36,4.36) v1(4.36,3.36) v1(4.36,2.36) v1(4.36,1.36) v1(5.36,98.7) v1(5.36,97.7) v1(5.36,96.7) v1(5.36,95.7) v1(5.36,85.7) v1(5.36,84.7) v1(5.36,83.7) v1(5.36,82.7) v1(5.36,81.7) v1(5.36,80.7) v1(5.36,79.7) v1(5.36,78.7) v1(5.36,77.7) v1(5.36,74.7) v1(5.36,73.7) v1(5.36,72.7) v1(5.36,71.7) v1(5.36,70.7) v1(5.36,69.7) v1(5.36,68.7) v1(5.36,67.7) v1(5.36,66.7) v1(5.36,65.7) v1(5.36,64.7) v1(5.36,63.7) v1(5.36,62.7) v1(5.36,59.7) v1(5.36,57.7) v1(5.36,45.36) v1(5.36,39.36) v1(5.36,38.36) v1(5.36,37.36) v1(5.36,36.36) v1(5.36,35.36) v1(5.36,34.36) v1(5.36,33.36) v1(5.36,32.36) v1(5.36,31.36) v1(5.36,30.36) v1(5.36,6.36) v1(5.36,5.36) v1(5.36,4.36) v1(5.36,3.36) v1(5.36,2.36) v1(5.36,1.36) v1(6.36,98.7) v1(6.36,97.7) v1(6.36,96.7) v1(6.36,95.7) v1(6.36,94.7) v1(6.36,89.7) v1(6.36,85.7) v1(6.36,84.7) v1(6.36,83.7) v1(6.36,82.7) v1(6.36,81.7) v1(6.36,80.7) v1(6.36,79.7) v1(6.36,78.7) v1(6.36,77.7) v1(6.36,76.7) v1(6.36,75.7) v1(6.36,74.7) v1(6.36,73.7) v1(6.36,72.7) v1(6.36,71.7) v1(6.36,70.7) v1(6.36,69.7) v1(6.36,68.7) v1(6.36,67.7) v1(6.36,66.7) v1(6.36,65.7) v1(6.36,64.7) v1(6.36,63.7) v1(6.36,62.7) v1(6.36,61.7) v1(6.36,60.7) v1(6.36,59.7) v1(6.36,44.36) v1(6.36,40.36) v1(6.36,39.36) v1(6.36,38.36) v1(6.36,37.36) v1(6.36,36.36) v1(6.36,35.36) v1(6.36,33.36) v1(6.36,12.36) v1(6.36,10.36) v1(6.36,4.36) v1(6.36,3.36) v1(6.36,2.36) v1(6.36,1.36) v1(7.36,98.7) v1(7.36,97.7) v1(7.36,96.7) v1(7.36,93.7) v1(7.36,92.7) v1(7.36,91.7) v1(7.36,90.7) v1(7.36,89.7) v1(7.36,85.7) v1(7.36,84.7) v1(7.36,83.7) v1(7.36,82.7) v1(7.36,81.7) v1(7.36,80.7) v1(7.36,79.7) v1(7.36,78.7) v1(7.36,77.7) v1(7.36,76.7) v1(7.36,75.7) v1(7.36,74.7) v1(7.36,73.7) v1(7.36,72.7) v1(7.36,71.7) v1(7.36,70.7) v1(7.36,69.7) v1(7.36,68.7) v1(7.36,67.7) v1(7.36,66.7) v1(7.36,65.7) v1(7.36,64.7) v1(7.36,63.7) v1(7.36,62.7) v1(7.36,61.7) v1(7.36,60.7) v1(7.36,59.7) v1(7.36,44.36) v1(7.36,43.36) v1(7.36,42.36) v1(7.36,41.36) v1(7.36,40.36) v1(7.36,38.36) v1(7.36,30.36) v1(7.36,27.36) v1(7.36,14.36) v1(7.36,13.36) v1(7.36,12.36) v1(7.36,7.36) v1(7.36,4.36) v1(7.36,3.36) v1(7.36,2.36) v1(7.36,1.36) v1(8.36,93.7) v1(8.36,92.7) v1(8.36,91.7) v1(8.36,90.7) v1(8.36,87.7) v1(8.36,61.7) v1(8.36,60.7) v1(8.36,59.7) v1(8.36,58.7) v1(8.36,57.7) v1(8.36,47.36) v1(8.36,46.36) v1(8.36,45.36) v1(8.36,35.36) v1(8.36,32.36) v1(8.36,17.36) v1(8.36,16.36) v1(8.36,15.36) v1(8.36,14.36) v1(8.36,13.36) v1(8.36,12.36) v1(8.36,8.36) v1(8.36,7.36) v1(8.36,6.36) v1(8.36,5.36) v1(8.36,4.36) v1(8.36,3.36) v1(8.36,2.36) v1(8.36,1.36) v1(8.6,51.7) v1(9.36,88.7) v1(9.36,40.36) v1(9.36,37.36) v1(9.36,35.36) v1(9.36,18.36) v1(9.36,17.36) v1(9.36,16.36) v1(9.36,15.36) v1(9.36,14.36) v1(9.36,13.36) v1(9.36,9.36) v1(9.36,8.36) v1(9.36,7.36) v1(9.36,6.36) v1(9.36,5.36) v1(9.36,4.36) v1(9.36,3.36) v1(9.36,2.36) v1(9.36,1.36) v1(9.6,51.7) v1(10.36,83.7) v1(10.36,82.7) v1(10.36,40.36) v1(10.36,32.36) v1(10.36,27.36) v1(10.36,26.36) v1(10.36,25.36) v1(10.36,24.36) v1(10.36,19.36) v1(10.36,18.36) v1(10.36,17.36) v1(10.36,16.36) v1(10.36,15.36) v1(10.36,14.36) v1(10.36,10.36) v1(10.36,9.36) v1(10.36,8.36) v1(10.36,7.36) v1(10.36,6.36) v1(10.36,5.36) v1(10.36,4.36) v1(10.36,3.36) v1(10.36,2.36) v1(10.36,1.36) v1(11.36,84.7) v1(11.36,80.7) v1(11.36,79.7) v1(11.36,75.7) v1(11.36,74.7) v1(11.36,73.7) v1(11.36,72.7) v1(11.36,71.7) v1(11.36,70.7) v1(11.36,69.7) v1(11.36,68.7) v1(11.36,67.7) v1(11.36,66.7) v1(11.36,47.36) v1(11.36,37.36) v1(11.36,32.36) v1(11.36,31.36) v1(11.36,28.36) v1(11.36,27.36) v1(11.36,26.36) v1(11.36,25.36) v1(11.36,20.36) v1(11.36,19.36) v1(11.36,18.36) v1(11.36,17.36) v1(11.36,16.36) v1(11.36,15.36) v1(11.36,11.36) v1(11.36,10.36) v1(11.36,9.36) v1(11.36,8.36) v1(11.36,7.36) v1(11.36,6.36) v1(11.36,5.36) v1(11.36,4.36) v1(11.36,3.36) v1(11.36,2.36) v1(11.36,1.36) v1(12.36,80.7) v1(12.36,75.7) v1(12.36,74.7) v1(12.36,73.7) v1(12.36,72.7) v1(12.36,71.7) v1(12.36,70.7) v1(12.36,69.7) v1(12.36,68.7) v1(12.36,67.7) v1(12.36,66.7) v1(12.36,42.36) v1(12.36,21.36) v1(12.36,20.36) v1(12.36,19.36) v1(12.36,18.36) v1(12.36,17.36) v1(12.36,16.36) v1(12.36,12.36) v1(12.36,11.36) v1(12.36,10.36) v1(12.36,9.36) v1(12.36,8.36) v1(12.36,7.36) v1(12.36,6.36) v1(12.36,5.36) v1(12.36,4.36) v1(12.36,3.36) v1(12.36,2.36) v1(12.36,1.36) v1(13.25,63.66) v1(13.36,80.7) v1(13.36,74.7) v1(13.36,73.7) v1(13.36,72.7) v1(13.36,71.7) v1(13.36,70.7) v1(13.36,69.7) v1(13.36,68.7) v1(13.36,67.7) v1(13.36,66.7) v1(13.36,44.36) v1(13.36,43.36) v1(13.36,42.36) v1(13.36,1.36) v1(14.36,80.7) v1(14.36,47.36) v1(14.36,45.36) v1(14.36,44.36) v1(14.36,43.36) v1(15.36,97.7) v1(15.36,96.7) v1(15.36,95.7) v1(15.36,94.7) v1(15.36,93.7) v1(15.36,92.7) v1(15.36,91.7) v1(15.36,90.7) v1(15.36,89.7) v1(15.36,88.7) v1(15.36,87.7) v1(15.36,86.7) v1(15.36,85.7) v1(15.36,84.7) v1(15.36,83.7) v1(15.36,82.7) v1(15.36,81.7) v1(15.36,80.7) v1(16.36,97.7) v1(16.36,96.7) v1(16.36,95.7) v1(16.36,94.7) v1(16.36,93.7) v1(16.36,92.7) v1(16.36,91.7) v1(16.36,90.7) v1(16.36,89.7) v1(16.36,88.7) v1(16.36,87.7) v1(16.36,86.7) v1(16.36,85.7) v1(16.36,84.7) v1(16.36,83.7) v1(16.36,82.7) v1(16.36,66.7) v1(16.36,65.7) v1(16.34,9.36) v1(16.34,8.36) v1(16.34,7.36) v1(16.61,46.19) v1(16.61,10.94) v1(17.02,64.44) v1(17.36,97.7) v1(17.36,96.7) v1(17.36,95.7) v1(17.36,94.7) v1(17.36,93.7) v1(17.36,92.7) v1(17.36,91.7) v1(17.36,90.7) v1(17.36,89.7) v1(17.36,88.7) v1(17.36,87.7) v1(17.36,86.7) v1(17.36,85.7) v1(17.36,84.7) v1(17.36,83.7) v1(17.36,82.7) v1(17.34,9.36) v1(17.34,8.36) v1(17.34,7.36) v1(18.36,97.7) v1(18.36,96.7) v1(18.36,95.7) v1(18.36,94.7) v1(18.36,93.7) v1(18.36,87.7) v1(18.36,86.7) v1(18.36,85.7) v1(18.36,84.7) v1(18.36,83.7) v1(18.36,82.7) v1(18.36,78.7) v1(18.34,8.36) v1(18.34,7.36) v1(19.36,97.7) v1(19.36,96.7) v1(19.36,95.7) v1(19.36,94.7) v1(19.36,87.7) v1(19.36,86.7) v1(19.36,85.7) v1(19.36,84.7) v1(19.36,83.7) v1(19.36,82.7) v1(19.34,8.36) v1(19.34,7.36) v1(19.34,2.36) v1(19.34,1.36) v1(19.61,38.69) v1(19.61,37.94) v1(19.61,37.19) v1(19.61,36.44) v1(19.61,35.69) v1(19.61,34.94) v1(19.61,34.19) v1(19.61,33.44) v1(19.61,32.69) v1(19.61,31.94) v1(19.61,31.19) v1(19.61,30.44) v1(19.61,29.69) v1(19.61,28.94) v1(19.61,28.19) v1(19.61,27.44) v1(19.61,26.69) v1(19.61,25.94) v1(19.61,25.19) v1(19.61,24.44) v1(19.61,23.69) v1(19.61,22.94) v1(19.61,22.19) v1(19.61,21.44) v1(19.61,20.69) v1(19.61,19.94) v1(19.61,19.19) v1(19.61,18.44) v1(19.61,17.69) v1(19.61,16.94) v1(19.61,16.19) v1(19.61,15.44) v1(19.61,14.69) v1(19.61,13.94) v1(19.61,13.19) v1(20.36,97.7) v1(20.36,96.7) v1(20.36,95.7) v1(20.36,94.7) v1(20.36,87.7) v1(20.36,86.7) v1(20.36,85.7) v1(20.36,84.7) v1(20.36,83.7) v1(20.36,82.7) v1(20.36,66.7) v1(20.36,39.44) v1(20.36,38.69) v1(20.36,37.94) v1(20.36,37.19) v1(20.36,36.44) v1(20.36,35.69) v1(20.36,34.94) v1(20.36,34.19) v1(20.36,33.44) v1(20.36,32.69) v1(20.36,31.94) v1(20.36,31.19) v1(20.36,30.44) v1(20.36,29.69) v1(20.36,28.94) v1(20.36,28.19) v1(20.36,27.44) v1(20.36,26.69) v1(20.36,25.94) v1(20.36,25.19) v1(20.36,24.44) v1(20.36,23.69) v1(20.36,22.94) v1(20.36,22.19) v1(20.36,21.44) v1(20.36,20.69) v1(20.36,19.94) v1(20.36,19.19) v1(20.36,18.44) v1(20.36,17.69) v1(20.36,16.94) v1(20.36,16.19) v1(20.36,15.44) v1(20.36,14.69) v1(20.36,13.94) v1(20.36,13.19) v1(20.36,12.44) v1(20.34,9.36) v1(20.34,8.36) v1(20.34,7.36) v1(20.34,2.36) v1(20.34,1.36) v1(20.72,62.34) v1(20.92,59.98) v1(21.11,40.19) v1(21.11,39.44) v1(21.11,38.69) v1(21.11,37.94) v1(21.11,37.19) v1(21.11,36.44) v1(21.11,35.69) v1(21.11,34.94) v1(21.11,34.19) v1(21.11,33.44) v1(21.11,32.69) v1(21.11,31.94) v1(21.11,31.19) v1(21.11,30.44) v1(21.11,29.69) v1(21.11,28.94) v1(21.11,28.19) v1(21.11,27.44) v1(21.11,26.69) v1(21.11,25.94) v1(21.11,25.19) v1(21.11,24.44) v1(21.11,23.69) v1(21.11,22.94) v1(21.11,22.19) v1(21.11,21.44) v1(21.11,20.69) v1(21.11,19.94) v1(21.11,19.19) v1(21.11,18.44) v1(21.11,17.69) v1(21.11,16.94) v1(21.11,16.19) v1(21.11,15.44) v1(21.11,14.69) v1(21.11,13.94) v1(21.11,13.19) v1(21.11,12.44) v1(21.11,11.69) v1(21.11,10.94) v1(21.36,97.7) v1(21.36,96.7) v1(21.36,95.7) v1(21.36,94.7) v1(21.36,87.7) v1(21.36,86.7) v1(21.36,85.7) v1(21.36,84.7) v1(21.36,83.7) v1(21.36,82.7) v1(21.34,9.36) v1(21.34,8.36) v1(21.34,7.36) v1(21.34,2.36) v1(21.34,1.36) v1(21.86,40.94) v1(21.86,40.19) v1(21.86,39.44) v1(21.86,38.69) v1(21.86,37.94) v1(21.86,37.19) v1(21.86,36.44) v1(21.86,35.69) v1(21.86,34.94) v1(21.86,34.19) v1(21.86,33.44) v1(21.86,32.69) v1(21.86,31.94) v1(21.86,31.19) v1(21.86,30.44) v1(21.86,29.69) v1(21.86,28.94) v1(21.86,28.19) v1(21.86,27.44) v1(21.86,26.69) v1(21.86,25.94) v1(21.86,25.19) v1(21.86,24.44) v1(21.86,23.69) v1(21.86,22.94) v1(21.86,22.19) v1(21.86,21.44) v1(21.86,20.69) v1(21.86,19.94) v1(21.86,19.19) v1(21.86,18.44) v1(21.86,17.69) v1(21.86,16.94) v1(21.86,16.19) v1(21.86,15.44) v1(21.86,14.69) v1(21.86,13.94) v1(21.86,13.19) v1(21.86,12.44) v1(21.86,11.69) v1(21.86,10.94) v1(22.36,97.7) v1(22.36,96.7) v1(22.36,95.7) v1(22.36,94.7) v1(22.36,87.7) v1(22.36,86.7) v1(22.36,85.7) v1(22.36,84.7) v1(22.36,83.7) v1(22.36,82.7) v1(22.36,73.7) v1(22.34,9.36) v1(22.34,8.36) v1(22.34,7.36) v1(22.34,2.36) v1(22.34,1.36) v1(22.61,41.69) v1(22.61,40.94) v1(22.61,40.19) v1(22.61,39.44) v1(22.61,38.69) v1(22.61,37.94) v1(22.61,37.19) v1(22.61,36.44) v1(22.61,35.69) v1(22.61,34.94) v1(22.61,34.19) v1(22.61,33.44) v1(22.61,32.69) v1(22.61,31.94) v1(22.61,31.19) v1(22.61,30.44) v1(22.61,29.69) v1(22.61,28.94) v1(22.61,28.19) v1(22.61,27.44) v1(22.61,26.69) v1(22.61,25.94) v1(22.61,25.19) v1(22.61,24.44) v1(22.61,23.69) v1(22.61,22.94) v1(22.61,22.19) v1(22.61,21.44) v1(22.61,20.69) v1(22.61,19.94) v1(22.61,19.19) v1(22.61,18.44) v1(22.61,17.69) v1(22.61,16.94) v1(22.61,16.19) v1(22.61,15.44) v1(22.61,14.69) v1(22.61,13.94) v1(22.61,13.19) v1(23.36,97.7) v1(23.36,96.7) v1(23.36,95.7) v1(23.36,94.7) v1(23.36,87.7) v1(23.36,86.7) v1(23.36,85.7) v1(23.36,84.7) v1(23.36,83.7) v1(23.36,82.7) v1(23.36,72.7) v1(23.36,42.44) v1(23.36,41.69) v1(23.36,40.94) v1(23.36,40.19) v1(23.36,39.44) v1(23.36,38.69) v1(23.36,37.94) v1(23.36,37.19) v1(23.36,36.44) v1(23.36,35.69) v1(23.36,34.94) v1(23.36,34.19) v1(23.36,33.44) v1(23.36,32.69) v1(23.36,31.94) v1(23.36,31.19) v1(23.36,30.44) v1(23.36,29.69) v1(23.36,28.94) v1(23.36,28.19) v1(23.36,27.44) v1(23.36,26.69) v1(23.36,25.94) v1(23.36,25.19) v1(23.36,24.44) v1(23.36,23.69) v1(23.36,22.94) v1(23.36,22.19) v1(23.36,21.44) v1(23.36,20.69) v1(23.36,19.94) v1(23.36,19.19) v1(23.36,18.44) v1(23.36,17.69) v1(23.36,16.94) v1(23.36,16.19) v1(23.36,15.44) v1(23.36,14.69) v1(23.36,13.94) v1(23.36,13.19) v1(23.34,8.36) v1(23.34,7.36) v1(23.34,2.36) v1(23.34,1.36) v1(24.11,49.19) v1(24.11,48.44) v1(24.11,47.69) v1(24.11,46.94) v1(24.11,46.19) v1(24.11,45.44) v1(24.11,44.69) v1(24.11,43.94) v1(24.11,43.19) v1(24.11,42.44) v1(24.11,41.69) v1(24.11,40.94) v1(24.11,40.19) v1(24.11,39.44) v1(24.11,38.69) v1(24.11,37.94) v1(24.11,37.19) v1(24.11,36.44) v1(24.11,35.69) v1(24.11,34.94) v1(24.11,34.19) v1(24.11,33.44) v1(24.11,32.69) v1(24.11,31.94) v1(24.11,31.19) v1(24.11,30.44) v1(24.11,29.69) v1(24.11,28.94) v1(24.11,28.19) v1(24.11,27.44) v1(24.11,26.69) v1(24.11,25.94) v1(24.11,25.19) v1(24.11,24.44) v1(24.11,23.69) v1(24.11,22.94) v1(24.11,22.19) v1(24.11,21.44) v1(24.11,20.69) v1(24.11,19.94) v1(24.11,19.19) v1(24.11,18.44) v1(24.11,17.69) v1(24.11,16.94) v1(24.11,16.19) v1(24.11,15.44) v1(24.11,14.69) v1(24.11,13.94) v1(24.36,97.7) v1(24.36,96.7) v1(24.36,95.7) v1(24.36,94.7) v1(24.36,93.7) v1(24.36,92.7) v1(24.36,91.7) v1(24.36,90.7) v1(24.36,89.7) v1(24.36,88.7) v1(24.36,87.7) v1(24.36,86.7) v1(24.36,85.7) v1(24.36,84.7) v1(24.36,83.7) v1(24.36,82.7) v1(24.34,8.36) v1(24.34,7.36) v1(24.34,2.36) v1(24.34,1.36) v1(24.86,49.19) v1(24.86,48.44) v1(24.86,47.69) v1(24.86,46.94) v1(24.86,46.19) v1(24.86,45.44) v1(24.86,44.69) v1(24.86,43.94) v1(24.86,43.19) v1(24.86,42.44) v1(24.86,41.69) v1(24.86,40.94) v1(24.86,40.19) v1(24.86,39.44) v1(24.86,38.69) v1(24.86,37.94) v1(24.86,37.19) v1(24.86,36.44) v1(24.86,35.69) v1(24.86,34.94) v1(24.86,34.19) v1(24.86,33.44) v1(24.86,32.69) v1(24.86,31.94) v1(24.86,31.19) v1(24.86,30.44) v1(24.86,29.69) v1(24.86,28.94) v1(24.86,28.19) v1(24.86,27.44) v1(24.86,26.69) v1(24.86,25.94) v1(24.86,25.19) v1(24.86,24.44) v1(24.86,23.69) v1(24.86,22.94) v1(24.86,22.19) v1(24.86,21.44) v1(24.86,20.69) v1(24.86,19.94) v1(24.86,19.19) v1(24.86,18.44) v1(24.86,17.69) v1(24.86,16.94) v1(24.86,16.19) v1(24.86,15.44) v1(24.86,14.69) v1(25.36,97.7) v1(25.36,96.7) v1(25.36,95.7) v1(25.36,94.7) v1(25.36,93.7) v1(25.36,92.7) v1(25.36,91.7) v1(25.36,90.7) v1(25.36,89.7) v1(25.36,88.7) v1(25.36,87.7) v1(25.36,86.7) v1(25.36,85.7) v1(25.36,84.7) v1(25.36,83.7) v1(25.36,82.7) v1(25.36,60.7) v1(25.36,59.7) v1(25.36,58.7) v1(25.34,9.36) v1(25.34,8.36) v1(25.34,7.36) v1(25.34,2.36) v1(25.34,1.36) v1(25.61,49.19) v1(25.61,48.44) v1(25.61,47.69) v1(25.61,46.94) v1(25.61,46.19) v1(25.61,45.44) v1(25.61,44.69) v1(25.61,43.94) v1(25.61,43.19) v1(25.61,42.44) v1(25.61,41.69) v1(25.61,40.94) v1(25.61,40.19) v1(25.61,39.44) v1(25.61,38.69) v1(25.61,37.94) v1(25.61,35.69) v1(25.61,34.94) v1(25.61,33.44) v1(25.61,32.69) v1(25.61,31.19) v1(25.61,30.44) v1(25.61,28.19) v1(25.61,27.44) v1(25.61,25.94) v1(25.61,25.19) v1(25.61,21.44) v1(25.61,20.69) v1(25.61,19.94) v1(25.61,19.19) v1(25.61,18.44) v1(25.61,17.69) v1(25.61,16.94) v1(25.61,16.19) v1(25.61,15.44) v1(26.36,97.7) v1(26.36,96.7) v1(26.36,95.7) v1(26.36,94.7) v1(26.36,93.7) v1(26.36,92.7) v1(26.36,91.7) v1(26.36,90.7) v1(26.36,89.7) v1(26.36,88.7) v1(26.36,87.7) v1(26.36,86.7) v1(26.36,85.7) v1(26.36,84.7) v1(26.36,83.7) v1(26.36,82.7) v1(26.36,73.7) v1(26.36,72.7) v1(26.36,71.7) v1(26.36,70.7) v1(26.36,69.7) v1(26.36,59.7) v1(26.36,58.7) v1(26.36,57.7) v1(26.36,49.19) v1(26.36,48.44) v1(26.36,47.69) v1(26.36,46.94) v1(26.36,46.19) v1(26.36,45.44) v1(26.36,44.69) v1(26.36,43.94) v1(26.36,43.19) v1(26.36,42.44) v1(26.36,41.69) v1(26.36,40.94) v1(26.36,40.19) v1(26.36,39.44) v1(26.36,38.69) v1(26.36,35.69) v1(26.36,30.44) v1(26.36,28.19) v1(26.36,21.44) v1(26.36,20.69) v1(26.36,19.94) v1(26.36,19.19) v1(26.36,18.44) v1(26.36,17.69) v1(26.36,16.94) v1(26.36,16.19) v1(26.36,10.94) v1(26.34,9.36) v1(26.34,8.36) v1(26.34,7.36) v1(26.34,2.36) v1(26.34,1.36) v1(27.11,49.19) v1(27.11,48.44) v1(27.11,47.69) v1(27.11,46.94) v1(27.11,46.19) v1(27.11,45.44) v1(27.11,44.69) v1(27.11,43.94) v1(27.11,43.19) v1(27.11,42.44) v1(27.11,41.69) v1(27.11,40.94) v1(27.11,40.19) v1(27.11,39.44) v1(27.11,38.69) v1(27.11,35.69) v1(27.11,30.44) v1(27.11,28.19) v1(27.11,21.44) v1(27.11,20.69) v1(27.11,19.94) v1(27.11,19.19) v1(27.11,18.44) v1(27.11,17.69) v1(27.11,16.94) v1(27.36,97.7) v1(27.36,96.7) v1(27.36,95.7) v1(27.36,94.7) v1(27.36,93.7) v1(27.36,92.7) v1(27.36,91.7) v1(27.36,90.7) v1(27.36,89.7) v1(27.36,88.7) v1(27.36,87.7) v1(27.36,86.7) v1(27.36,85.7) v1(27.36,84.7) v1(27.36,83.7) v1(27.36,73.7) v1(27.36,72.7) v1(27.36,71.7) v1(27.36,70.7) v1(27.34,8.36) v1(27.34,7.36) v1(27.34,2.36) v1(27.34,1.36) v1(27.86,49.19) v1(27.86,48.44) v1(27.86,47.69) v1(27.86,46.94) v1(27.86,46.19) v1(27.86,45.44) v1(27.86,44.69) v1(27.86,43.94) v1(27.86,43.19) v1(27.86,42.44) v1(27.86,41.69) v1(27.86,40.94) v1(27.86,40.19) v1(27.86,39.44) v1(27.86,38.69) v1(27.86,35.69) v1(27.86,30.44) v1(27.86,28.19) v1(27.86,21.44) v1(27.86,20.69) v1(27.86,19.94) v1(27.86,19.19) v1(27.86,18.44) v1(27.86,17.69) v1(28.36,97.7) v1(28.36,96.7) v1(28.36,95.7) v1(28.36,94.7) v1(28.36,93.7) v1(28.36,92.7) v1(28.36,91.7) v1(28.36,90.7) v1(28.36,89.7) v1(28.36,88.7) v1(28.36,87.7) v1(28.36,86.7) v1(28.36,85.7) v1(28.36,84.7) v1(28.36,75.7) v1(28.36,74.7) v1(28.36,73.7) v1(28.36,72.7) v1(28.36,71.7) v1(28.34,8.36) v1(28.34,7.36) v1(28.34,2.36) v1(28.34,1.36) v1(28.61,49.19) v1(28.61,48.44) v1(28.61,47.69) v1(28.61,46.94) v1(28.61,46.19) v1(28.61,45.44) v1(28.61,44.69) v1(28.61,43.94) v1(28.61,43.19) v1(28.61,42.44) v1(28.61,41.69) v1(28.61,40.94) v1(28.61,40.19) v1(28.61,39.44) v1(28.61,38.69) v1(28.61,37.94) v1(28.61,35.69) v1(28.61,33.44) v1(28.61,30.44) v1(28.61,28.19) v1(28.61,21.44) v1(28.61,20.69) v1(28.61,19.94) v1(28.61,19.19) v1(28.61,18.44) v1(28.61,13.19) v1(29.36,97.7) v1(29.36,96.7) v1(29.36,95.7) v1(29.36,94.7) v1(29.36,93.7) v1(29.36,92.7) v1(29.36,91.7) v1(29.36,90.7) v1(29.36,89.7) v1(29.36,88.7) v1(29.36,87.7) v1(29.36,86.7) v1(29.36,85.7) v1(29.36,84.7) v1(29.36,76.7) v1(29.36,75.7) v1(29.36,74.7) v1(29.36,73.7) v1(29.36,72.7) v1(29.36,49.19) v1(29.36,48.44) v1(29.36,47.69) v1(29.36,46.94) v1(29.36,46.19) v1(29.36,45.44) v1(29.36,44.69) v1(29.36,43.94) v1(29.36,43.19) v1(29.36,42.44) v1(29.36,41.69) v1(29.36,40.94) v1(29.36,40.19) v1(29.36,39.44) v1(29.36,38.69) v1(29.36,37.94) v1(29.36,37.19) v1(29.36,36.44) v1(29.36,35.69) v1(29.36,34.94) v1(29.36,34.19) v1(29.36,33.44) v1(29.36,32.69) v1(29.36,31.94) v1(29.36,31.19) v1(29.36,30.44) v1(29.36,29.69) v1(29.36,28.94) v1(29.36,28.19) v1(29.36,27.44) v1(29.36,26.69) v1(29.36,25.94) v1(29.36,25.19) v1(29.36,24.44) v1(29.36,23.69) v1(29.36,22.94) v1(29.36,22.19) v1(29.36,21.44) v1(29.36,20.69) v1(29.36,19.94) v1(29.36,19.19) v1(29.36,13.94) v1(29.36,13.19) v1(29.34,8.36) v1(29.34,7.36) v1(30.11,49.19) v1(30.11,48.44) v1(30.11,47.69) v1(30.11,46.94) v1(30.11,46.19) v1(30.11,45.44) v1(30.11,44.69) v1(30.11,43.94) v1(30.11,43.19) v1(30.11,42.44) v1(30.11,41.69) v1(30.11,40.94) v1(30.11,40.19) v1(30.11,39.44) v1(30.11,38.69) v1(30.11,37.94) v1(30.11,37.19) v1(30.11,36.44) v1(30.11,35.69) v1(30.11,34.94) v1(30.11,34.19) v1(30.11,33.44) v1(30.11,32.69) v1(30.11,31.94) v1(30.11,31.19) v1(30.11,30.44) v1(30.11,29.69) v1(30.11,28.94) v1(30.11,28.19) v1(30.11,27.44) v1(30.11,26.69) v1(30.11,25.94) v1(30.11,25.19) v1(30.11,24.44) v1(30.11,23.69) v1(30.11,22.94) v1(30.11,22.19) v1(30.11,21.44) v1(30.11,20.69) v1(30.11,19.94) v1(30.11,14.69) v1(30.11,13.94) v1(30.11,13.19) v1(30.36,76.7) v1(30.36,75.7) v1(30.36,74.7) v1(30.36,73.7) v1(30.36,72.7) v1(30.34,9.36) v1(30.34,8.36) v1(30.34,7.36) v1(30.86,49.19) v1(30.86,48.44) v1(30.86,47.69) v1(30.86,46.94) v1(30.86,46.19) v1(30.86,45.44) v1(30.86,44.69) v1(30.86,43.94) v1(30.86,43.19) v1(30.86,42.44) v1(30.86,41.69) v1(30.86,40.94) v1(30.86,40.19) v1(30.86,39.44) v1(30.86,38.69) v1(30.86,37.94) v1(30.86,37.19) v1(30.86,36.44) v1(30.86,35.69) v1(30.86,34.94) v1(30.86,34.19) v1(30.86,33.44) v1(30.86,32.69) v1(30.86,31.94) v1(30.86,31.19) v1(30.86,30.44) v1(30.86,29.69) v1(30.86,28.94) v1(30.86,28.19) v1(30.86,27.44) v1(30.86,26.69) v1(30.86,25.94) v1(30.86,25.19) v1(30.86,24.44) v1(30.86,23.69) v1(30.86,22.94) v1(30.86,22.19) v1(30.86,21.44) v1(30.86,20.69) v1(30.86,15.44) v1(30.86,14.69) v1(30.86,13.94) v1(30.86,13.19) v1(30.86,12.44) v1(30.86,11.69) v1(30.86,10.94) v1(31.36,77.7) v1(31.36,76.7) v1(31.36,75.7) v1(31.36,74.7) v1(31.36,73.7) v1(31.36,72.7) v1(31.36,71.7) v1(31.34,9.36) v1(31.34,8.36) v1(31.34,7.36) v1(31.34,6.36) v1(31.61,49.19) v1(31.61,48.44) v1(31.61,47.69) v1(31.61,46.94) v1(31.61,46.19) v1(31.61,45.44) v1(31.61,44.69) v1(31.61,43.94) v1(31.61,43.19) v1(31.61,42.44) v1(31.61,41.69) v1(31.61,40.94) v1(31.61,40.19) v1(31.61,39.44) v1(31.61,38.69) v1(31.61,37.94) v1(31.61,37.19) v1(31.61,36.44) v1(31.61,35.69) v1(31.61,34.94) v1(31.61,34.19) v1(31.61,33.44) v1(31.61,32.69) v1(31.61,31.94) v1(31.61,31.19) v1(31.61,30.44) v1(31.61,29.69) v1(31.61,28.94) v1(31.61,28.19) v1(31.61,27.44) v1(31.61,26.69) v1(31.61,25.94) v1(31.61,25.19) v1(31.61,24.44) v1(31.61,23.69) v1(31.61,22.94) v1(31.61,22.19) v1(31.61,21.44) v1(31.61,16.19) v1(31.61,15.44) v1(31.61,14.69) v1(31.61,13.94) v1(31.61,13.19) v1(31.61,12.44) v1(31.61,11.69) v1(31.61,10.94) v1(32.36,77.7) v1(32.36,76.7) v1(32.36,75.7) v1(32.36,74.7) v1(32.36,73.7) v1(32.36,72.7) v1(32.36,71.7) v1(32.36,70.7) v1(32.36,49.19) v1(32.36,48.44) v1(32.36,47.69) v1(32.36,46.94) v1(32.36,46.19) v1(32.36,45.44) v1(32.36,44.69) v1(32.36,43.94) v1(32.36,43.19) v1(32.36,42.44) v1(32.36,41.69) v1(32.36,40.94) v1(32.36,40.19) v1(32.36,39.44) v1(32.36,38.69) v1(32.36,37.94) v1(32.36,37.19) v1(32.36,36.44) v1(32.36,35.69) v1(32.36,34.94) v1(32.36,34.19) v1(32.36,33.44) v1(32.36,32.69) v1(32.36,31.94) v1(32.36,26.69) v1(32.36,25.94) v1(32.36,25.19) v1(32.36,24.44) v1(32.36,23.69) v1(32.36,22.94) v1(32.36,22.19) v1(32.36,16.94) v1(32.36,16.19) v1(32.36,15.44) v1(32.36,14.69) v1(32.36,13.94) v1(32.36,13.19) v1(32.36,12.44) v1(32.36,11.69) v1(32.36,10.94) v1(32.34,9.36) v1(32.34,8.36) v1(32.34,7.36) v1(32.34,6.36) v1(32.34,5.36) v1(32.34,1.36) v1(33.11,49.19) v1(33.11,48.44) v1(33.11,47.69) v1(33.11,46.94) v1(33.11,46.19) v1(33.11,45.44) v1(33.11,44.69) v1(33.11,43.94) v1(33.11,43.19) v1(33.11,42.44) v1(33.11,41.69) v1(33.11,40.94) v1(33.11,40.19) v1(33.11,39.44) v1(33.11,38.69) v1(33.11,37.94) v1(33.11,37.19) v1(33.11,36.44) v1(33.11,35.69) v1(33.11,34.94) v1(33.11,34.19) v1(33.11,33.44) v1(33.11,32.69) v1(33.11,25.94) v1(33.11,25.19) v1(33.11,24.44) v1(33.11,23.69) v1(33.11,22.94) v1(33.11,17.69) v1(33.11,16.94) v1(33.11,16.19) v1(33.11,15.44) v1(33.11,14.69) v1(33.11,13.94) v1(33.11,13.19) v1(33.11,12.44) v1(33.11,11.69) v1(33.11,10.94) v1(33.36,77.7) v1(33.36,76.7) v1(33.36,75.7) v1(33.36,74.7) v1(33.36,73.7) v1(33.36,72.7) v1(33.36,69.7) v1(33.34,9.36) v1(33.34,8.36) v1(33.34,7.36) v1(33.34,6.36) v1(33.34,5.36) v1(33.34,1.36) v1(33.86,49.19) v1(33.86,48.44) v1(33.86,47.69) v1(33.86,46.94) v1(33.86,46.19) v1(33.86,45.44) v1(33.86,44.69) v1(33.86,43.94) v1(33.86,43.19) v1(33.86,42.44) v1(33.86,41.69) v1(33.86,40.94) v1(33.86,40.19) v1(33.86,39.44) v1(33.86,38.69) v1(33.86,37.94) v1(33.86,37.19) v1(33.86,36.44) v1(33.86,35.69) v1(33.86,34.94) v1(33.86,34.19) v1(33.86,33.44) v1(33.86,25.94) v1(33.86,25.19) v1(33.86,24.44) v1(33.86,23.69) v1(33.86,18.44) v1(33.86,17.69) v1(33.86,16.94) v1(33.86,16.19) v1(33.86,15.44) v1(33.86,14.69) v1(33.86,13.94) v1(33.86,13.19) v1(33.86,12.44) v1(33.86,11.69) v1(33.86,10.94) v1(34.34,9.36) v1(34.34,8.36) v1(34.34,7.36) v1(34.34,1.36) v1(34.61,49.19) v1(34.61,48.44) v1(34.61,47.69) v1(34.61,46.94) v1(34.61,46.19) v1(34.61,45.44) v1(34.61,44.69) v1(34.61,43.94) v1(34.61,43.19) v1(34.61,42.44) v1(34.61,41.69) v1(34.61,40.94) v1(34.61,40.19) v1(34.61,39.44) v1(34.61,38.69) v1(34.61,37.94) v1(34.61,37.19) v1(34.61,36.44) v1(34.61,35.69) v1(34.61,34.94) v1(34.61,34.19) v1(34.61,33.44) v1(34.61,25.19) v1(34.61,24.44) v1(34.61,19.19) v1(34.61,18.44) v1(34.61,17.69) v1(34.61,16.94) v1(34.61,16.19) v1(34.61,15.44) v1(34.61,14.69) v1(34.61,13.94) v1(34.61,13.19) v1(34.61,12.44) v1(34.61,11.69) v1(34.61,10.94) v1(35.36,81.7) v1(35.36,49.19) v1(35.36,48.44) v1(35.36,47.69) v1(35.36,46.94) v1(35.36,46.19) v1(35.36,45.44) v1(35.36,44.69) v1(35.36,43.94) v1(35.36,43.19) v1(35.36,42.44) v1(35.36,41.69) v1(35.36,40.94) v1(35.36,40.19) v1(35.36,39.44) v1(35.36,38.69) v1(35.36,37.94) v1(35.36,37.19) v1(35.36,36.44) v1(35.36,35.69) v1(35.36,34.94) v1(35.36,34.19) v1(35.36,33.44) v1(35.36,25.19) v1(35.36,19.94) v1(35.36,19.19) v1(35.36,18.44) v1(35.36,17.69) v1(35.36,16.94) v1(35.36,16.19) v1(35.36,15.44) v1(35.36,14.69) v1(35.36,13.94) v1(35.36,13.19) v1(35.36,12.44) v1(35.36,11.69) v1(35.36,10.94) v1(35.34,9.36) v1(35.34,8.36) v1(35.34,1.36) v1(36.11,49.19) v1(36.11,48.44) v1(36.11,47.69) v1(36.11,46.94) v1(36.11,46.19) v1(36.11,45.44) v1(36.11,44.69) v1(36.11,43.94) v1(36.11,43.19) v1(36.11,42.44) v1(36.11,41.69) v1(36.11,40.94) v1(36.11,40.19) v1(36.11,39.44) v1(36.11,38.69) v1(36.11,37.94) v1(36.11,37.19) v1(36.11,36.44) v1(36.11,35.69) v1(36.11,34.94) v1(36.11,34.19) v1(36.11,33.44) v1(36.11,20.69) v1(36.11,19.94) v1(36.11,19.19) v1(36.11,18.44) v1(36.11,17.69) v1(36.11,16.94) v1(36.11,16.19) v1(36.11,15.44) v1(36.11,14.69) v1(36.11,13.94) v1(36.11,13.19) v1(36.11,12.44) v1(36.11,11.69) v1(36.11,10.94) v1(36.28,92.35) v1(36.28,91.35) v1(36.36,84.7) v1(36.36,83.7) v1(36.36,82.7) v1(36.36,81.7) v1(36.36,80.7) v1(36.36,73.7) v1(36.36,72.7) v1(36.36,62.7) v1(36.34,9.36) v1(36.34,8.36) v1(36.34,7.36) v1(36.34,1.36) v1(36.86,49.19) v1(36.86,48.44) v1(36.86,47.69) v1(36.86,46.94) v1(36.86,46.19) v1(36.86,45.44) v1(36.86,44.69) v1(36.86,43.94) v1(36.86,43.19) v1(36.86,42.44) v1(36.86,41.69) v1(36.86,40.94) v1(36.86,40.19) v1(36.86,39.44) v1(36.86,38.69) v1(36.86,37.94) v1(36.86,37.19) v1(36.86,36.44) v1(36.86,35.69) v1(36.86,34.94) v1(36.86,34.19) v1(36.86,33.44) v1(36.86,21.44) v1(36.86,20.69) v1(36.86,19.94) v1(36.86,19.19) v1(36.86,18.44) v1(36.86,17.69) v1(36.86,16.94) v1(36.86,16.19) v1(36.86,15.44) v1(36.86,14.69) v1(36.86,13.94) v1(36.86,13.19) v1(36.86,12.44) v1(36.86,11.69) v1(36.86,10.94) v1(37.28,92.35) v1(37.28,91.35) v1(37.36,85.7) v1(37.36,84.7) v1(37.36,83.7) v1(37.36,82.7) v1(37.36,81.7) v1(37.36,80.7) v1(37.36,79.7) v1(37.36,74.7) v1(37.36,73.7) v1(37.36,72.7) v1(37.34,9.36) v1(37.34,8.36) v1(37.34,7.36) v1(37.34,6.36) v1(37.34,5.36) v1(37.34,1.36) v1(37.61,49.19) v1(37.61,48.44) v1(37.61,47.69) v1(37.61,46.94) v1(37.61,46.19) v1(37.61,45.44) v1(37.61,44.69) v1(37.61,43.94) v1(37.61,43.19) v1(37.61,42.44) v1(37.61,41.69) v1(37.61,40.94) v1(37.61,40.19) v1(37.61,39.44) v1(37.61,38.69) v1(37.61,37.94) v1(37.61,37.19) v1(37.61,36.44) v1(37.61,35.69) v1(37.61,34.94) v1(37.61,34.19) v1(37.61,33.44) v1(37.61,22.19) v1(37.61,21.44) v1(37.61,20.69) v1(37.61,19.94) v1(37.61,19.19) v1(37.61,18.44) v1(37.61,17.69) v1(37.61,16.94) v1(37.61,16.19) v1(37.61,15.44) v1(37.61,14.69) v1(37.61,13.94) v1(37.61,13.19) v1(37.61,12.44) v1(37.61,11.69) v1(37.61,10.94) v1(38.28,92.35) v1(38.36,85.7) v1(38.36,84.7) v1(38.36,83.7) v1(38.36,82.7) v1(38.36,81.7) v1(38.36,80.7) v1(38.36,76.7) v1(38.36,75.7) v1(38.36,74.7) v1(38.36,73.7) v1(38.36,65.7) v1(38.36,64.7) v1(38.36,49.19) v1(38.36,48.44) v1(38.36,47.69) v1(38.36,46.94) v1(38.36,46.19) v1(38.36,45.44) v1(38.36,44.69) v1(38.36,43.94) v1(38.36,43.19) v1(38.36,42.44) v1(38.36,41.69) v1(38.36,40.94) v1(38.36,40.19) v1(38.36,39.44) v1(38.36,38.69) v1(38.36,37.94) v1(38.36,37.19) v1(38.36,36.44) v1(38.36,35.69) v1(38.36,34.94) v1(38.36,34.19) v1(38.36,33.44) v1(38.36,32.69) v1(38.36,22.94) v1(38.36,22.19) v1(38.36,21.44) v1(38.36,20.69) v1(38.36,19.94) v1(38.36,19.19) v1(38.36,18.44) v1(38.36,17.69) v1(38.36,16.94) v1(38.36,16.19) v1(38.36,15.44) v1(38.36,14.69) v1(38.36,13.94) v1(38.36,13.19) v1(38.36,12.44) v1(38.36,11.69) v1(38.36,10.94) v1(38.34,9.36) v1(38.34,8.36) v1(38.34,7.36) v1(38.34,6.36) v1(38.34,1.36) v1(39.11,49.19) v1(39.11,48.44) v1(39.11,47.69) v1(39.11,46.94) v1(39.11,46.19) v1(39.11,45.44) v1(39.11,44.69) v1(39.11,43.94) v1(39.11,43.19) v1(39.11,42.44) v1(39.11,41.69) v1(39.11,40.94) v1(39.11,40.19) v1(39.11,39.44) v1(39.11,38.69) v1(39.11,37.94) v1(39.11,37.19) v1(39.11,36.44) v1(39.11,35.69) v1(39.11,34.94) v1(39.11,34.19) v1(39.11,33.44) v1(39.11,32.69) v1(39.11,31.94) v1(39.11,31.19) v1(39.11,23.69) v1(39.11,22.94) v1(39.11,22.19) v1(39.11,21.44) v1(39.11,20.69) v1(39.11,19.94) v1(39.11,19.19) v1(39.11,18.44) v1(39.11,17.69) v1(39.11,16.94) v1(39.11,16.19) v1(39.11,15.44) v1(39.11,14.69) v1(39.11,13.94) v1(39.11,13.19) v1(39.11,12.44) v1(39.11,11.69) v1(39.11,10.94) v1(39.37,92.13) v1(39.36,85.7) v1(39.36,84.7) v1(39.36,83.7) v1(39.36,82.7) v1(39.36,81.7) v1(39.36,77.7) v1(39.36,76.7) v1(39.36,75.7) v1(39.36,74.7) v1(39.34,9.36) v1(39.34,8.36) v1(39.34,7.36) v1(39.34,1.36) v1(39.86,49.19) v1(39.86,48.44) v1(39.86,47.69) v1(39.86,46.94) v1(39.86,46.19) v1(39.86,45.44) v1(39.86,44.69) v1(39.86,43.94) v1(39.86,43.19) v1(39.86,42.44) v1(39.86,41.69) v1(39.86,40.94) v1(39.86,40.19) v1(39.86,39.44) v1(39.86,38.69) v1(39.86,37.94) v1(39.86,37.19) v1(39.86,36.44) v1(39.86,35.69) v1(39.86,34.94) v1(39.86,34.19) v1(39.86,33.44) v1(39.86,32.69) v1(39.86,31.94) v1(39.86,31.19) v1(39.86,30.44) v1(39.86,29.69) v1(39.86,24.44) v1(39.86,23.69) v1(39.86,22.94) v1(39.86,22.19) v1(39.86,21.44) v1(39.86,20.69) v1(39.86,19.94) v1(39.86,19.19) v1(39.86,18.44) v1(39.86,17.69) v1(39.86,16.94) v1(39.86,16.19) v1(39.86,15.44) v1(39.86,14.69) v1(39.86,13.94) v1(39.86,13.19) v1(39.86,12.44) v1(39.86,11.69) v1(39.86,10.94) v1(40.28,92.35) v1(40.36,85.7) v1(40.36,84.7) v1(40.36,83.7) v1(40.36,82.7) v1(40.36,78.7) v1(40.36,77.7) v1(40.36,76.7) v1(40.36,75.7) v1(40.34,9.36) v1(40.34,8.36) v1(40.34,2.36) v1(40.34,1.36) v1(40.61,49.19) v1(40.61,48.44) v1(40.61,47.69) v1(40.61,46.94) v1(40.61,46.19) v1(40.61,45.44) v1(40.61,44.69) v1(40.61,43.94) v1(40.61,43.19) v1(40.61,42.44) v1(40.61,41.69) v1(40.61,40.94) v1(40.61,40.19) v1(40.61,39.44) v1(40.61,38.69) v1(40.61,37.94) v1(40.61,37.19) v1(40.61,36.44) v1(40.61,35.69) v1(40.61,34.94) v1(40.61,34.19) v1(40.61,33.44) v1(40.61,32.69) v1(40.61,31.94) v1(40.61,31.19) v1(40.61,30.44) v1(40.61,25.19) v1(40.61,24.44) v1(40.61,23.69) v1(40.61,22.94) v1(40.61,22.19) v1(40.61,21.44) v1(40.61,20.69) v1(40.61,19.94) v1(40.61,19.19) v1(40.61,18.44) v1(40.61,17.69) v1(40.61,16.94) v1(40.61,16.19) v1(40.61,15.44) v1(40.61,14.69) v1(40.61,13.94) v1(40.61,13.19) v1(40.61,12.44) v1(40.61,11.69) v1(40.61,10.94) v1(41.28,92.35) v1(41.28,91.35) v1(41.36,85.7) v1(41.36,84.7) v1(41.36,83.7) v1(41.36,79.7) v1(41.36,78.7) v1(41.36,77.7) v1(41.36,76.7) v1(41.36,49.19) v1(41.36,48.44) v1(41.36,47.69) v1(41.36,46.94) v1(41.36,46.19) v1(41.36,45.44) v1(41.36,44.69) v1(41.36,43.94) v1(41.36,43.19) v1(41.36,42.44) v1(41.36,41.69) v1(41.36,40.94) v1(41.36,40.19) v1(41.36,39.44) v1(41.36,38.69) v1(41.36,37.94) v1(41.36,35.69) v1(41.36,33.44) v1(41.36,25.94) v1(41.36,25.19) v1(41.36,22.94) v1(41.36,22.19) v1(41.36,21.44) v1(41.36,20.69) v1(41.36,19.94) v1(41.36,19.19) v1(41.36,18.44) v1(41.36,17.69) v1(41.36,16.94) v1(41.36,16.19) v1(41.36,15.44) v1(41.36,14.69) v1(41.36,13.94) v1(41.36,13.19) v1(41.36,12.44) v1(41.36,11.69) v1(41.36,10.94) v1(41.34,9.36) v1(41.34,8.36) v1(41.34,7.36) v1(41.34,3.36) v1(41.34,2.36) v1(41.34,1.36) v1(41.78,58.72) v1(42.11,49.19) v1(42.11,48.44) v1(42.11,47.69) v1(42.11,46.94) v1(42.11,46.19) v1(42.11,45.44) v1(42.11,44.69) v1(42.11,43.94) v1(42.11,43.19) v1(42.11,42.44) v1(42.11,41.69) v1(42.11,40.94) v1(42.11,40.19) v1(42.11,39.44) v1(42.11,38.69) v1(42.11,35.69) v1(42.11,22.94) v1(42.11,22.19) v1(42.11,21.44) v1(42.11,20.69) v1(42.11,19.94) v1(42.11,19.19) v1(42.11,18.44) v1(42.11,17.69) v1(42.11,16.94) v1(42.11,16.19) v1(42.11,15.44) v1(42.11,14.69) v1(42.11,13.94) v1(42.11,13.19) v1(42.11,12.44) v1(42.11,11.69) v1(42.11,10.94) v1(42.28,92.35) v1(42.28,91.35) v1(42.36,80.7) v1(42.36,79.7) v1(42.36,78.7) v1(42.36,77.7) v1(42.34,9.36) v1(42.34,8.36) v1(42.34,7.36) v1(42.34,6.36) v1(42.34,5.36) v1(42.34,4.36) v1(42.34,3.36) v1(42.34,2.36) v1(42.34,1.36) v1(42.86,49.19) v1(42.86,48.44) v1(42.86,47.69) v1(42.86,46.94) v1(42.86,46.19) v1(42.86,45.44) v1(42.86,44.69) v1(42.86,43.94) v1(42.86,43.19) v1(42.86,42.44) v1(42.86,41.69) v1(42.86,40.94) v1(42.86,40.19) v1(42.86,39.44) v1(42.86,38.69) v1(42.86,35.69) v1(42.86,22.94) v1(42.86,22.19) v1(42.86,21.44) v1(42.86,20.69) v1(42.86,19.94) v1(42.86,19.19) v1(42.86,18.44) v1(42.86,17.69) v1(42.86,16.94) v1(42.86,16.19) v1(42.86,15.44) v1(42.86,14.69) v1(42.86,13.94) v1(42.86,13.19) v1(42.86,12.44) v1(42.86,11.69) v1(42.86,10.94) v1(43.28,91.35) v1(43.35,95.94) v1(43.36,81.7) v1(43.36,80.7) v1(43.36,79.7) v1(43.36,78.7) v1(43.34,9.36) v1(43.34,8.36) v1(43.34,7.36) v1(43.34,6.36) v1(43.34,5.36) v1(43.34,4.36) v1(43.34,3.36) v1(43.34,2.36) v1(43.34,1.36) v1(43.61,48.44) v1(43.61,47.69) v1(43.61,46.94) v1(43.61,46.19) v1(43.61,45.44) v1(43.61,44.69) v1(43.61,43.94) v1(43.61,43.19) v1(43.61,42.44) v1(43.61,41.69) v1(43.61,40.94) v1(43.61,40.19) v1(43.61,39.44) v1(43.61,38.69) v1(43.61,28.19) v1(43.61,22.94) v1(43.61,22.19) v1(43.61,21.44) v1(43.61,20.69) v1(43.61,19.94) v1(43.61,19.19) v1(43.61,18.44) v1(43.61,17.69) v1(43.61,16.94) v1(43.61,16.19) v1(43.61,15.44) v1(43.61,14.69) v1(43.61,13.94) v1(43.61,13.19) v1(43.61,12.44) v1(43.61,11.69) v1(43.61,10.94) v1(44.36,47.69) v1(44.36,44.69) v1(44.36,43.94) v1(44.36,43.19) v1(44.36,42.44) v1(44.36,41.69) v1(44.36,40.94) v1(44.36,40.19) v1(44.36,28.19) v1(44.36,22.94) v1(44.36,22.19) v1(44.36,21.44) v1(44.36,20.69) v1(44.36,19.94) v1(44.36,19.19) v1(44.36,18.44) v1(44.36,17.69) v1(44.36,16.94) v1(44.36,16.19) v1(44.36,15.44) v1(44.36,14.69) v1(44.36,13.94) v1(44.36,13.19) v1(44.36,12.44) v1(44.36,11.69) v1(44.36,10.94) v1(44.34,9.36) v1(44.34,8.36) v1(44.34,7.36) v1(44.34,4.36) v1(44.34,3.36) v1(44.34,2.36) v1(44.34,1.36) v1(44.96,97.55) v1(44.96,94.42) v1(45.11,43.94) v1(45.11,43.19) v1(45.11,42.44) v1(45.11,41.69) v1(45.11,40.94) v1(45.11,34.94) v1(45.11,29.69) v1(45.11,28.94) v1(45.11,28.19) v1(45.11,25.19) v1(45.11,24.44) v1(45.11,23.69) v1(45.11,22.94) v1(45.11,22.19) v1(45.11,21.44) v1(45.11,20.69) v1(45.11,19.94) v1(45.11,19.19) v1(45.11,18.44) v1(45.11,17.69) v1(45.11,16.94) v1(45.11,16.19) v1(45.11,15.44) v1(45.11,14.69) v1(45.11,13.94) v1(45.11,13.19) v1(45.11,12.44) v1(45.11,11.69) v1(45.11,10.94) v1(45.36,76.7) v1(45.34,9.36) v1(45.34,8.36) v1(45.34,3.36) v1(45.34,2.36) v1(45.34,1.36) v1(45.86,43.19) v1(45.86,42.44) v1(45.86,41.69) v1(45.86,40.94) v1(45.86,40.19) v1(45.86,35.69) v1(45.86,25.94) v1(45.86,25.19) v1(45.86,24.44) v1(45.86,23.69) v1(45.86,22.94) v1(45.86,22.19) v1(45.86,21.44) v1(45.86,20.69) v1(45.86,19.94) v1(45.86,19.19) v1(45.86,18.44) v1(45.86,17.69) v1(45.86,16.94) v1(45.86,16.19) v1(45.86,15.44) v1(45.86,14.69) v1(45.86,13.94) v1(45.86,13.19) v1(45.86,12.44) v1(45.86,11.69) v1(45.86,10.94) v1(46.36,85.7) v1(46.36,81.7) v1(46.34,9.36) v1(46.34,8.36) v1(46.34,7.36) v1(46.34,2.36) v1(46.34,1.36) v1(46.54,95.94) v1(46.61,48.44) v1(46.61,43.94) v1(46.61,43.19) v1(46.61,42.44) v1(46.61,41.69) v1(46.61,40.94) v1(46.61,26.69) v1(46.61,25.94) v1(46.61,25.19) v1(46.61,24.44) v1(46.61,23.69) v1(46.61,22.94) v1(46.61,22.19) v1(46.61,21.44) v1(46.61,20.69) v1(46.61,19.94) v1(46.61,19.19) v1(46.61,18.44) v1(46.61,17.69) v1(46.61,16.94) v1(46.61,16.19) v1(46.61,15.44) v1(46.61,14.69) v1(46.61,13.94) v1(46.61,13.19) v1(46.61,12.44) v1(46.61,11.69) v1(46.61,10.94) v1(46.69,99.31) v1(47.36,85.7) v1(47.36,44.69) v1(47.36,43.94) v1(47.36,43.19) v1(47.36,42.44) v1(47.36,41.69) v1(47.36,40.94) v1(47.36,30.44) v1(47.36,29.69) v1(47.36,27.44) v1(47.36,26.69) v1(47.36,25.94) v1(47.36,25.19) v1(47.36,24.44) v1(47.36,23.69) v1(47.36,22.94) v1(47.36,22.19) v1(47.36,21.44) v1(47.36,20.69) v1(47.36,19.94) v1(47.36,19.19) v1(47.36,18.44) v1(47.36,17.69) v1(47.36,16.94) v1(47.36,16.19) v1(47.36,15.44) v1(47.36,14.69) v1(47.36,13.94) v1(47.36,13.19) v1(47.36,12.44) v1(47.36,11.69) v1(47.36,10.94) v1(47.34,9.36) v1(47.34,8.36) v1(47.34,7.36) v1(47.34,1.36) v1(48.11,43.94) v1(48.11,43.19) v1(48.11,42.44) v1(48.11,41.69) v1(48.11,40.94) v1(48.11,40.19) v1(48.11,39.44) v1(48.11,37.19) v1(48.11,36.44) v1(48.11,35.69) v1(48.11,30.44) v1(48.11,29.69) v1(48.11,27.44) v1(48.11,26.69) v1(48.11,25.94) v1(48.11,25.19) v1(48.11,24.44) v1(48.11,23.69) v1(48.11,22.94) v1(48.11,22.19) v1(48.11,21.44) v1(48.11,20.69) v1(48.11,19.94) v1(48.11,19.19) v1(48.11,18.44) v1(48.11,17.69) v1(48.11,16.94) v1(48.11,16.19) v1(48.11,15.44) v1(48.11,14.69) v1(48.11,13.94) v1(48.11,13.19) v1(48.11,12.44) v1(48.11,11.69) v1(48.11,10.94) v1(48.36,95.7) v1(48.34,9.36) v1(48.34,8.36) v1(48.34,7.36) v1(48.34,6.36) v1(48.86,46.19) v1(48.86,43.19) v1(48.86,42.44) v1(48.86,41.69) v1(48.86,40.94) v1(48.86,40.19) v1(48.86,39.44) v1(48.86,37.19) v1(48.86,36.44) v1(48.86,35.69) v1(48.86,30.44) v1(48.86,29.69) v1(48.86,27.44) v1(48.86,26.69) v1(48.86,25.94) v1(48.86,25.19) v1(48.86,24.44) v1(48.86,23.69) v1(48.86,22.94) v1(48.86,22.19) v1(48.86,21.44) v1(48.86,20.69) v1(48.86,19.94) v1(48.86,19.19) v1(48.86,18.44) v1(48.86,17.69) v1(48.86,16.94) v1(48.86,16.19) v1(48.86,15.44) v1(48.86,14.69) v1(48.86,13.94) v1(48.86,13.19) v1(48.86,12.44) v1(48.86,11.69) v1(48.86,10.94) v1(49.36,79.7) v1(49.36,55.7) v1(49.34,9.36) v1(49.34,8.36) v1(49.34,7.36) v1(49.34,6.36) v1(49.34,5.36) v1(49.53,49.45) v1(49.61,45.44) v1(49.61,43.19) v1(49.61,42.44) v1(49.61,41.69) v1(49.61,40.94) v1(49.61,40.19) v1(49.61,37.19) v1(49.61,36.44) v1(49.61,35.69) v1(49.61,30.44) v1(49.61,29.69) v1(49.61,27.44) v1(49.61,26.69) v1(49.61,25.94) v1(49.61,25.19) v1(49.61,24.44) v1(49.61,23.69) v1(49.61,22.94) v1(49.61,22.19) v1(49.61,21.44) v1(49.61,20.69) v1(49.61,19.94) v1(49.61,19.19) v1(49.61,18.44) v1(49.61,17.69) v1(49.61,16.94) v1(49.61,16.19) v1(49.61,15.44) v1(49.61,14.69) v1(49.61,13.94) v1(49.61,13.19) v1(49.61,12.44) v1(49.61,11.69) v1(49.61,10.94) v1(50.36,95.7) v1(50.36,85.7) v1(50.36,80.7) v1(50.36,79.7) v1(50.36,75.7) v1(50.36,60.7) v1(50.36,55.7) v1(50.36,54.7) v1(50.36,43.19) v1(50.36,42.44) v1(50.36,41.69) v1(50.36,40.94) v1(50.36,37.94) v1(50.36,37.19) v1(50.36,36.44) v1(50.36,35.69) v1(50.36,30.44) v1(50.36,29.69) v1(50.36,27.44) v1(50.36,26.69) v1(50.36,25.94) v1(50.36,25.19) v1(50.36,24.44) v1(50.36,23.69) v1(50.36,22.94) v1(50.36,22.19) v1(50.36,21.44) v1(50.36,20.69) v1(50.36,19.94) v1(50.36,19.19) v1(50.36,18.44) v1(50.36,17.69) v1(50.36,16.94) v1(50.36,16.19) v1(50.36,15.44) v1(50.36,14.69) v1(50.36,13.94) v1(50.36,13.19) v1(50.36,12.44) v1(50.36,11.69) v1(50.36,10.94) v1(50.34,9.36) v1(50.34,8.36) v1(50.34,7.36) v1(50.34,6.36) v1(50.34,5.36) v1(50.34,4.36) v1(50.55,50.47) v1(50.55,49.46) v1(51.11,43.19) v1(51.11,42.44) v1(51.11,41.69) v1(51.11,38.69) v1(51.11,37.94) v1(51.11,37.19) v1(51.11,36.44) v1(51.11,35.69) v1(51.11,30.44) v1(51.11,29.69) v1(51.11,27.44) v1(51.11,26.69) v1(51.11,25.94) v1(51.11,25.19) v1(51.11,24.44) v1(51.11,23.69) v1(51.11,22.94) v1(51.11,22.19) v1(51.11,21.44) v1(51.11,20.69) v1(51.11,19.94) v1(51.11,19.19) v1(51.11,18.44) v1(51.11,17.69) v1(51.11,16.94) v1(51.11,16.19) v1(51.11,15.44) v1(51.11,14.69) v1(51.11,13.94) v1(51.11,13.19) v1(51.11,12.44) v1(51.11,11.69) v1(51.11,10.94) v1(51.36,95.7) v1(51.36,75.7) v1(51.36,74.7) v1(51.36,60.7) v1(51.36,55.7) v1(51.36,54.7) v1(51.36,53.7) v1(51.34,9.36) v1(51.34,8.36) v1(51.34,7.36) v1(51.34,3.36) v1(51.86,43.19) v1(51.86,42.44) v1(51.86,39.44) v1(51.86,38.69) v1(51.86,37.94) v1(51.86,37.19) v1(51.86,36.44) v1(51.86,35.69) v1(51.86,30.44) v1(51.86,29.69) v1(51.86,27.44) v1(51.86,26.69) v1(51.86,25.94) v1(51.86,25.19) v1(51.86,24.44) v1(51.86,23.69) v1(51.86,22.94) v1(51.86,22.19) v1(51.86,21.44) v1(51.86,20.69) v1(51.86,19.94) v1(51.86,19.19) v1(51.86,18.44) v1(51.86,17.69) v1(51.86,16.94) v1(51.86,16.19) v1(51.86,15.44) v1(51.86,14.69) v1(51.86,13.94) v1(51.86,13.19) v1(51.86,12.44) v1(51.86,11.69) v1(51.86,10.94) v1(52.36,75.7) v1(52.36,74.7) v1(52.36,73.7) v1(52.36,63.7) v1(52.36,61.7) v1(52.36,55.7) v1(52.36,54.7) v1(52.36,53.7) v1(52.34,9.36) v1(52.34,8.36) v1(52.34,7.36) v1(52.34,3.36) v1(52.39,98.44) v1(52.61,40.19) v1(52.61,39.44) v1(52.61,38.69) v1(52.61,37.94) v1(52.61,37.19) v1(52.61,36.44) v1(52.61,35.69) v1(52.61,30.44) v1(52.61,29.69) v1(52.61,27.44) v1(52.61,26.69) v1(52.61,25.94) v1(52.61,25.19) v1(52.61,24.44) v1(52.61,23.69) v1(52.61,22.94) v1(52.61,22.19) v1(52.61,21.44) v1(52.61,20.69) v1(52.61,19.94) v1(52.61,19.19) v1(52.61,18.44) v1(52.61,17.69) v1(52.61,16.94) v1(52.61,16.19) v1(52.61,15.44) v1(52.61,14.69) v1(52.61,13.94) v1(52.61,13.19) v1(52.61,12.44) v1(52.61,11.69) v1(52.61,10.94) v1(53.36,74.7) v1(53.36,73.7) v1(53.36,72.7) v1(53.36,67.7) v1(53.36,66.7) v1(53.36,65.7) v1(53.36,64.7) v1(53.36,56.7) v1(53.36,55.7) v1(53.36,54.7) v1(53.36,53.7) v1(53.36,40.94) v1(53.36,40.19) v1(53.36,39.44) v1(53.36,38.69) v1(53.36,37.94) v1(53.36,37.19) v1(53.36,36.44) v1(53.36,35.69) v1(53.36,30.44) v1(53.36,29.69) v1(53.36,27.44) v1(53.36,26.69) v1(53.36,25.94) v1(53.36,25.19) v1(53.36,24.44) v1(53.36,23.69) v1(53.36,22.94) v1(53.36,22.19) v1(53.36,21.44) v1(53.36,20.69) v1(53.36,19.94) v1(53.36,19.19) v1(53.36,18.44) v1(53.36,17.69) v1(53.36,16.94) v1(53.36,16.19) v1(53.36,15.44) v1(53.36,14.69) v1(53.36,13.94) v1(53.36,13.19) v1(53.36,12.44) v1(53.36,11.69) v1(53.36,10.94) v1(53.34,9.36) v1(53.34,8.36) v1(53.34,7.36) v1(53.34,3.36) v1(53.39,98.44) v1(54.11,41.69) v1(54.11,40.94) v1(54.11,40.19) v1(54.11,39.44) v1(54.11,38.69) v1(54.11,37.94) v1(54.11,37.19) v1(54.11,36.44) v1(54.11,30.44) v1(54.11,29.69) v1(54.11,27.44) v1(54.11,26.69) v1(54.11,25.94) v1(54.11,25.19) v1(54.11,24.44) v1(54.11,23.69) v1(54.11,22.94) v1(54.11,22.19) v1(54.11,21.44) v1(54.11,20.69) v1(54.11,19.94) v1(54.11,19.19) v1(54.11,18.44) v1(54.11,17.69) v1(54.11,16.94) v1(54.11,16.19) v1(54.11,15.44) v1(54.11,14.69) v1(54.11,13.94) v1(54.11,13.19) v1(54.11,12.44) v1(54.11,11.69) v1(54.11,10.94) v1(54.36,73.7) v1(54.36,72.7) v1(54.36,71.7) v1(54.36,66.7) v1(54.36,65.7) v1(54.36,64.7) v1(54.36,60.7) v1(54.36,56.7) v1(54.36,55.7) v1(54.36,54.7) v1(54.36,53.7) v1(54.34,9.36) v1(54.34,8.36) v1(54.34,3.36) v1(54.85,49.44) v1(54.86,42.44) v1(54.86,41.69) v1(54.86,40.94) v1(54.86,40.19) v1(54.86,39.44) v1(54.86,38.69) v1(54.86,37.94) v1(54.86,37.19) v1(54.86,31.19) v1(54.86,30.44) v1(54.86,29.69) v1(54.86,27.44) v1(54.86,26.69) v1(54.86,25.94) v1(54.86,25.19) v1(54.86,24.44) v1(54.86,23.69) v1(54.86,22.94) v1(54.86,22.19) v1(54.86,21.44) v1(54.86,20.69) v1(54.86,19.94) v1(54.86,19.19) v1(54.86,18.44) v1(54.86,17.69) v1(54.86,16.94) v1(54.86,16.19) v1(54.86,15.44) v1(54.86,14.69) v1(54.86,13.94) v1(54.86,13.19) v1(54.86,12.44) v1(54.86,11.69) v1(54.86,10.94) v1(55.36,86.7) v1(55.36,84.7) v1(55.36,82.7) v1(55.36,81.7) v1(55.36,80.7) v1(55.36,79.7) v1(55.36,72.7) v1(55.36,71.7) v1(55.36,65.7) v1(55.36,64.7) v1(55.36,60.7) v1(56.36,84.7) v1(56.36,83.7) v1(56.36,82.7) v1(56.36,81.7) v1(56.36,80.7) v1(56.36,79.7) v1(56.36,78.7) v1(56.36,77.7) v1(56.36,71.7) v1(56.36,63.7) v1(56.36,62.7) v1(56.36,61.7) v1(56.36,60.7) v1(56.36,59.7) v1(56.39,98.44) v1(56.39,97.44) v1(57.36,94.7) v1(57.36,93.7) v1(57.36,89.7) v1(57.36,85.7) v1(57.36,84.7) v1(57.36,83.7) v1(57.36,82.7) v1(57.36,81.7) v1(57.36,80.7) v1(57.36,79.7) v1(57.36,78.7) v1(57.36,77.7) v1(57.36,76.7) v1(57.36,68.7) v1(57.36,57.7) v1(57.36,56.7) v1(57.36,53.7) v1(57.33,51.7) v1(57.39,98.44) v1(57.39,97.44) v1(58.36,89.7) v1(58.36,85.7) v1(58.36,84.7) v1(58.36,83.7) v1(58.36,82.7) v1(58.36,81.7) v1(58.36,80.7) v1(58.36,79.7) v1(58.36,78.7) v1(58.36,77.7) v1(58.36,76.7) v1(58.36,75.7) v1(58.36,69.7) v1(58.36,68.7) v1(58.36,58.7) v1(58.36,57.7) v1(58.36,54.7) v1(58.36,53.7) v1(58.33,51.7) v1(59.36,89.7) v1(59.36,85.7) v1(59.36,84.7) v1(59.36,83.7) v1(59.36,82.7) v1(59.36,81.7) v1(59.36,80.7) v1(59.36,79.7) v1(59.36,78.7) v1(59.36,77.7) v1(59.36,76.7) v1(59.36,75.7) v1(59.36,74.7) v1(59.36,68.7) v1(59.36,67.7) v1(59.36,66.7) v1(59.36,65.7) v1(59.36,64.7) v1(59.36,63.7) v1(59.36,59.7) v1(59.36,58.7) v1(59.36,55.7) v1(59.36,54.7) v1(59.36,53.7) v1(59.33,51.7) v1(62.86,88.92) v1(66.27,69.43) v1(66.29,70.66) v1(67.44,70.66) v1(67.44,69.43) v1(79.07,26.11) v1(83.95,30.66) v2(81.66,78.16) v2(81.67,75.62) v2(82.93,76.89) v2(84.2,78.16) v2(84.2,75.62) v2(85.45,66.44) v4(3.98,92.3) v4(3.98,42.3) v4(78.98,42.3) v4(93.98,87.3) v5(86.87,96.95)
